# Altium project LVM PLC.PrjPcb
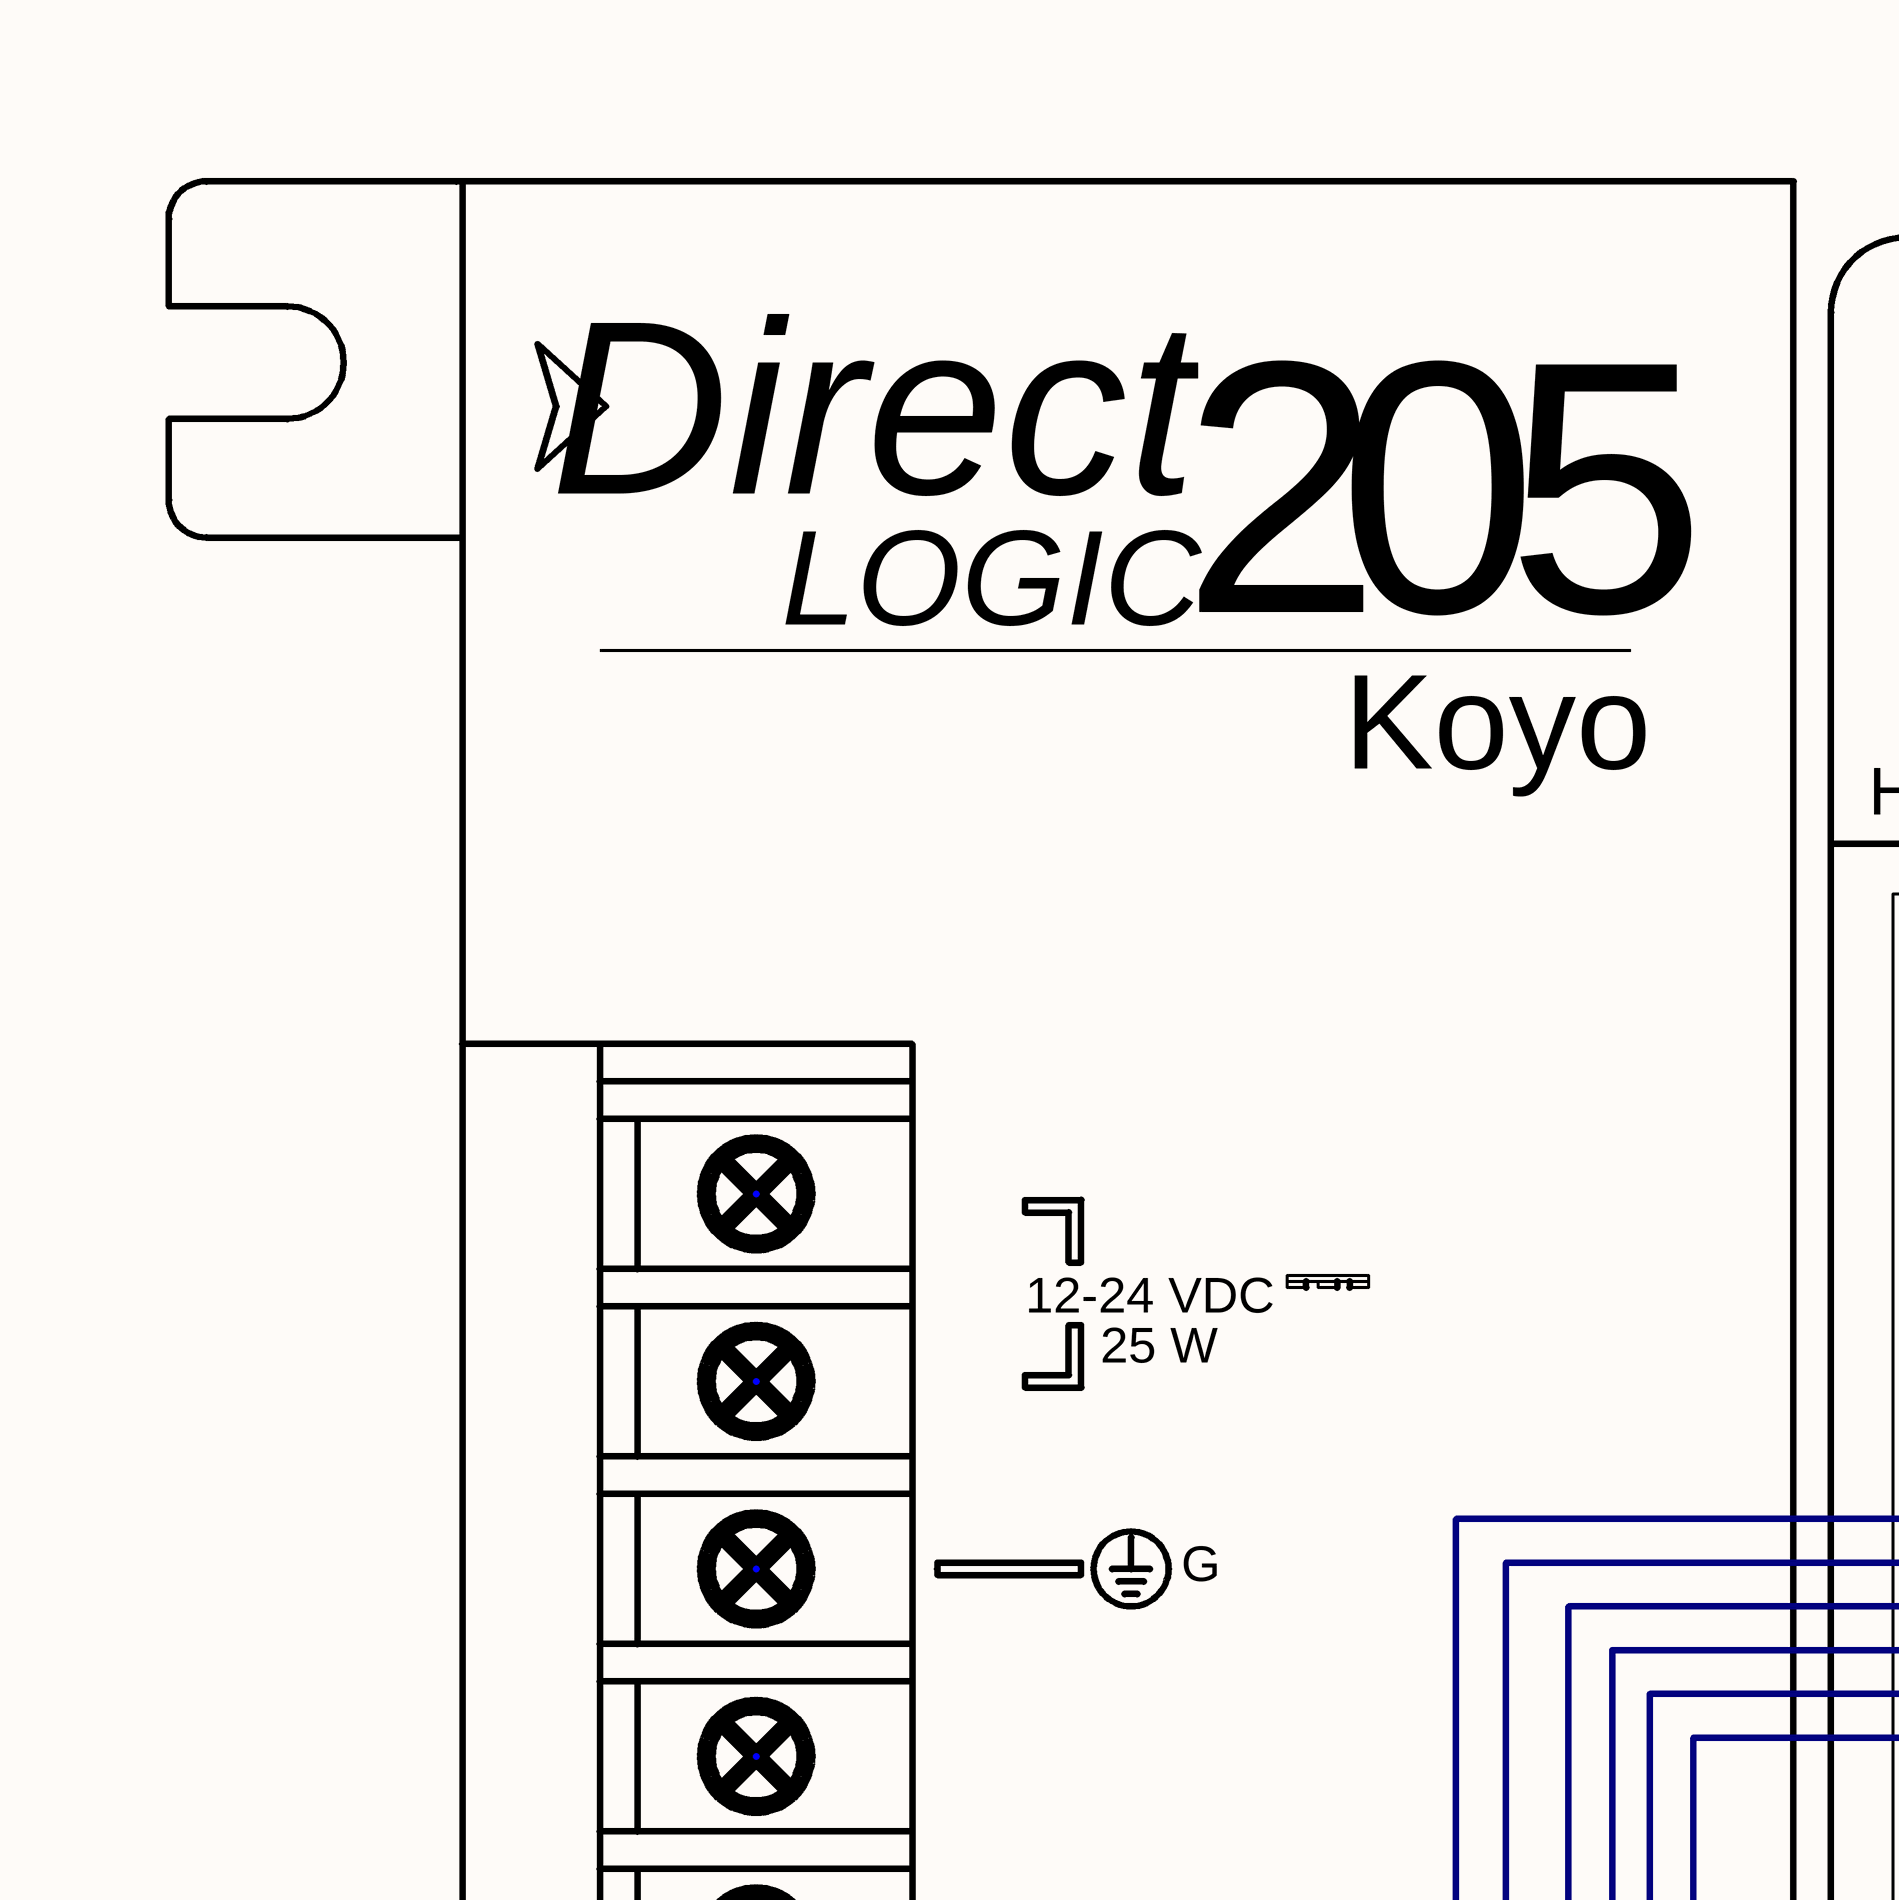
[diagram p0: LVM main.SchDoc, top column 1 of 4]
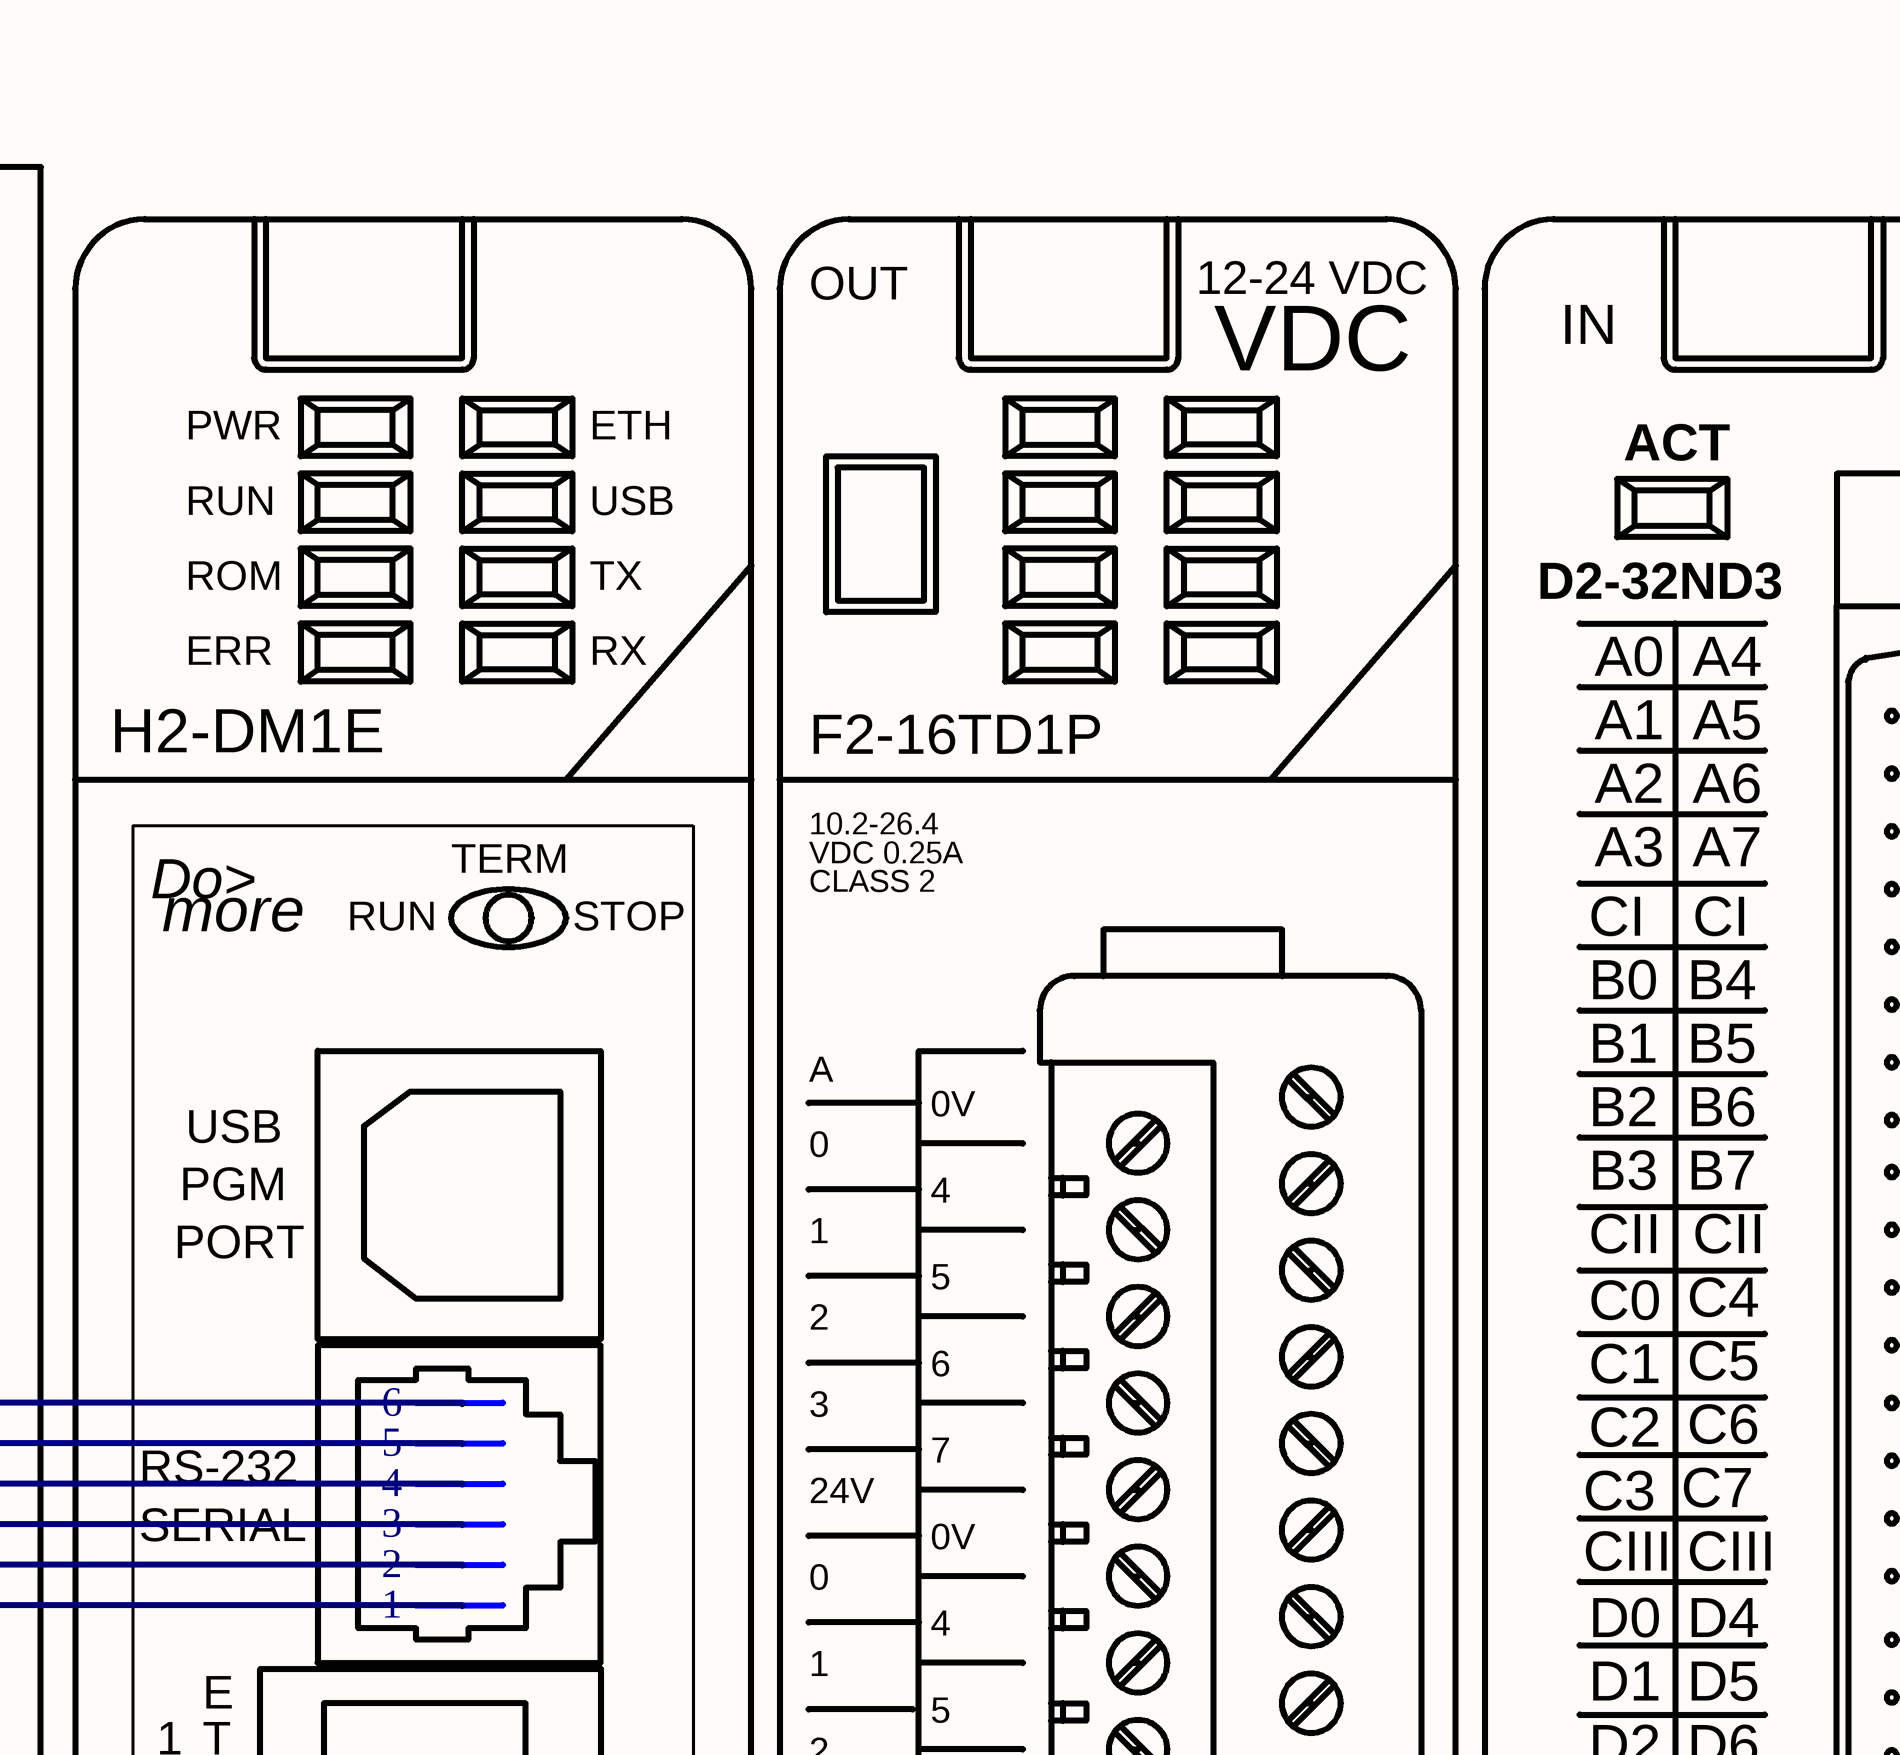
[diagram p1: LVM main.SchDoc, top column 2 of 4]
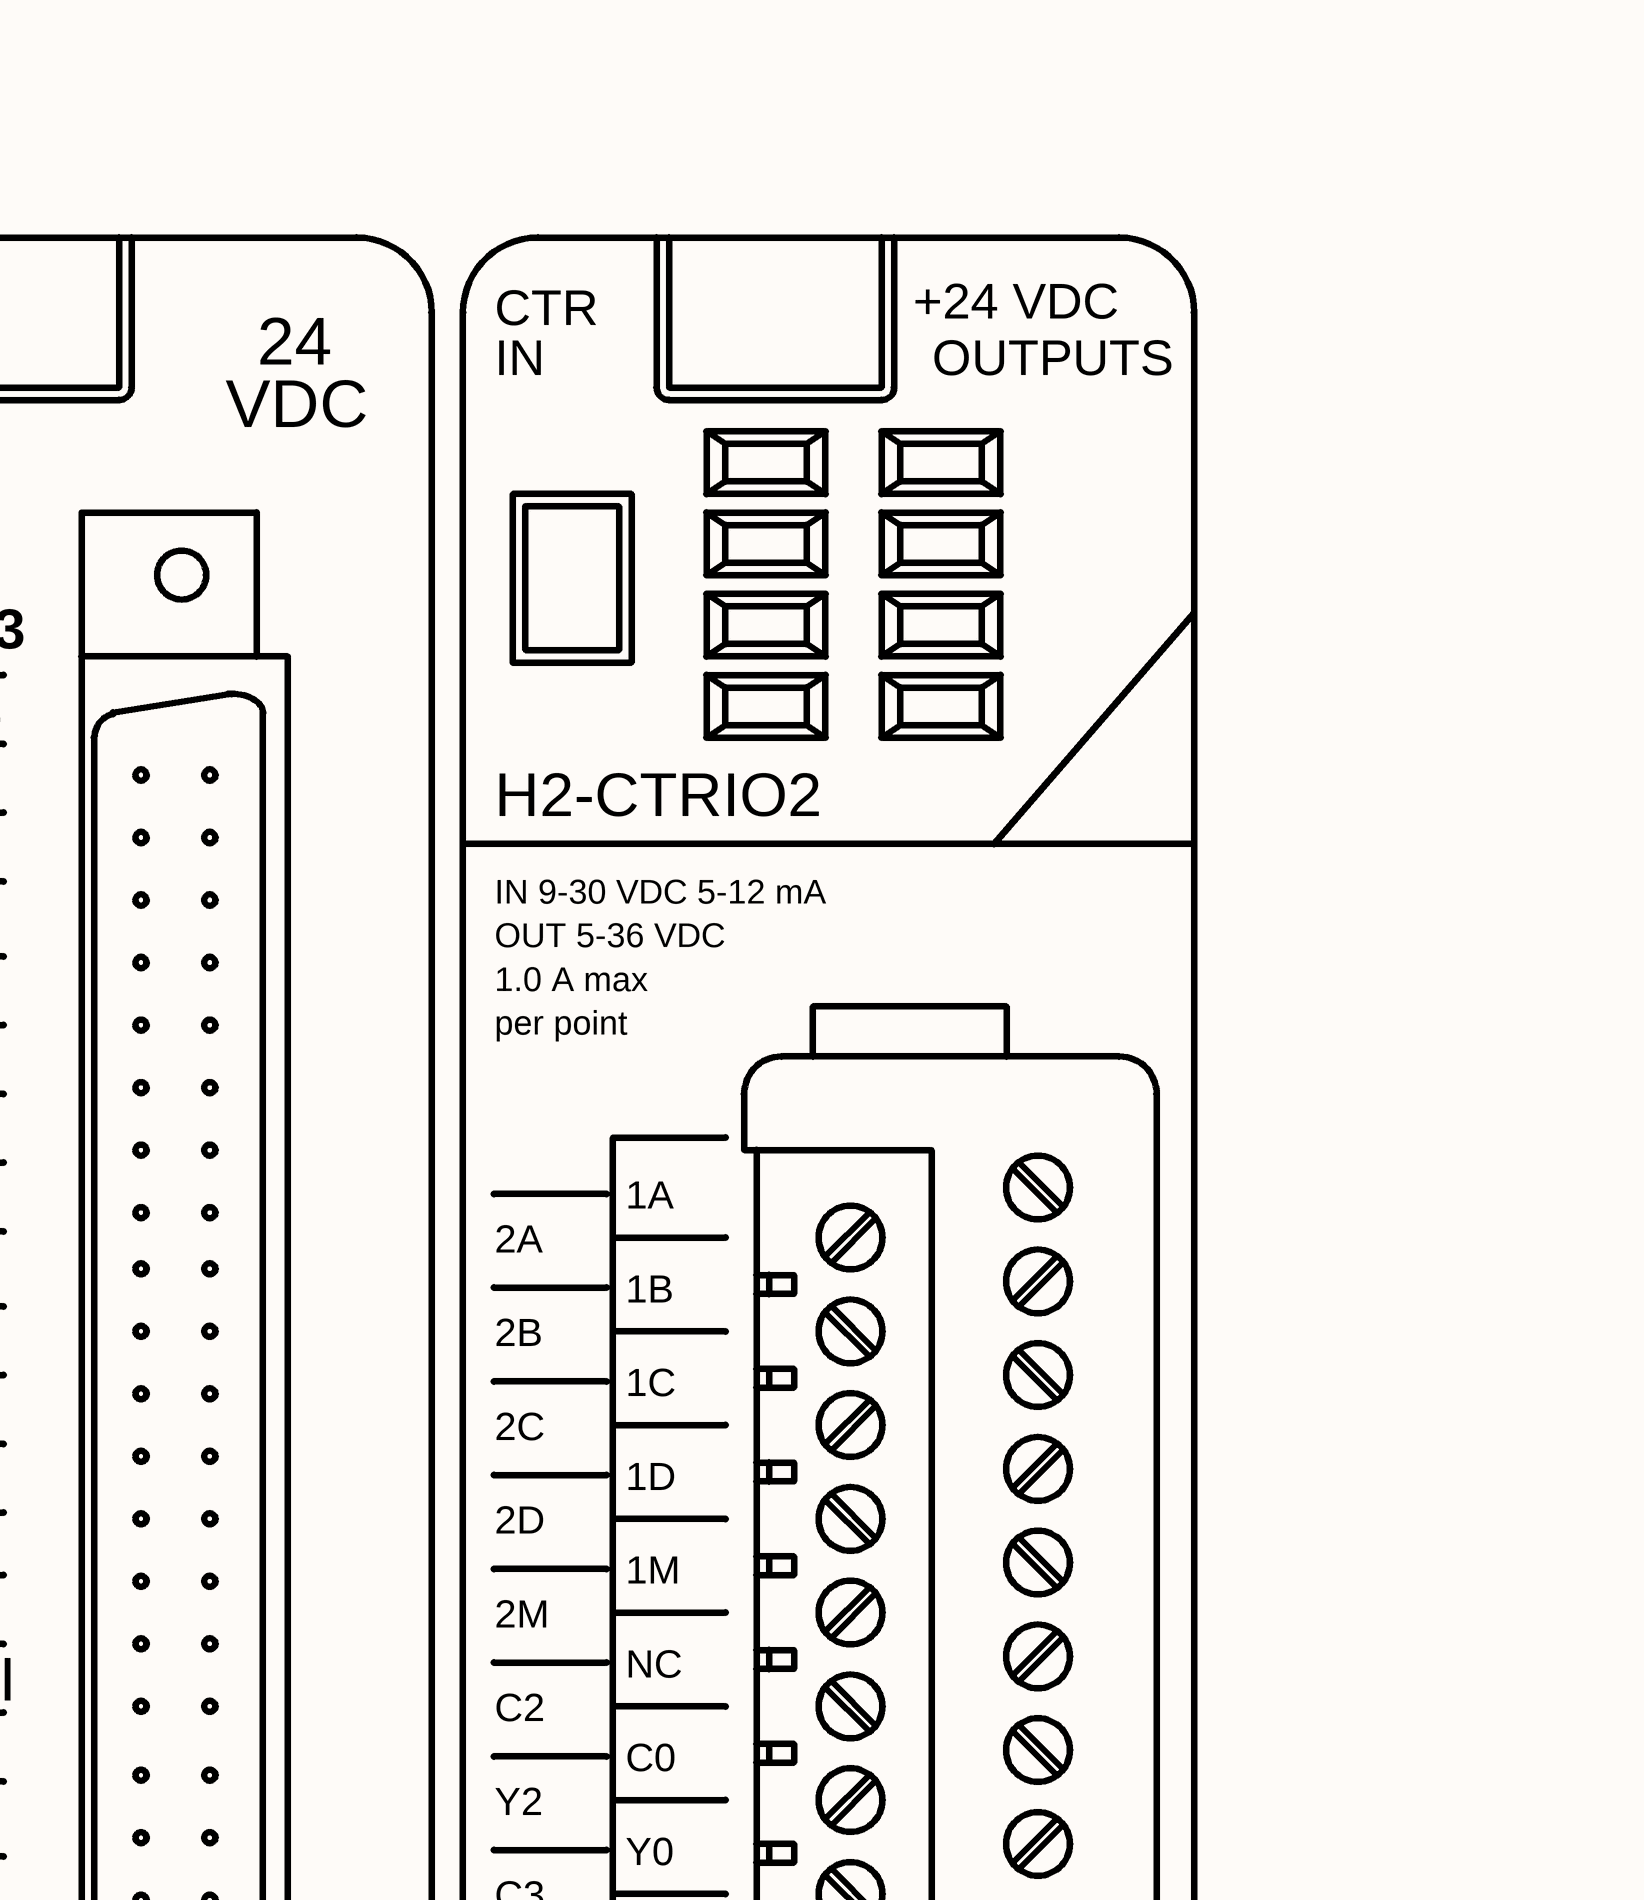
[diagram p2: LVM main.SchDoc, top column 3 of 4]
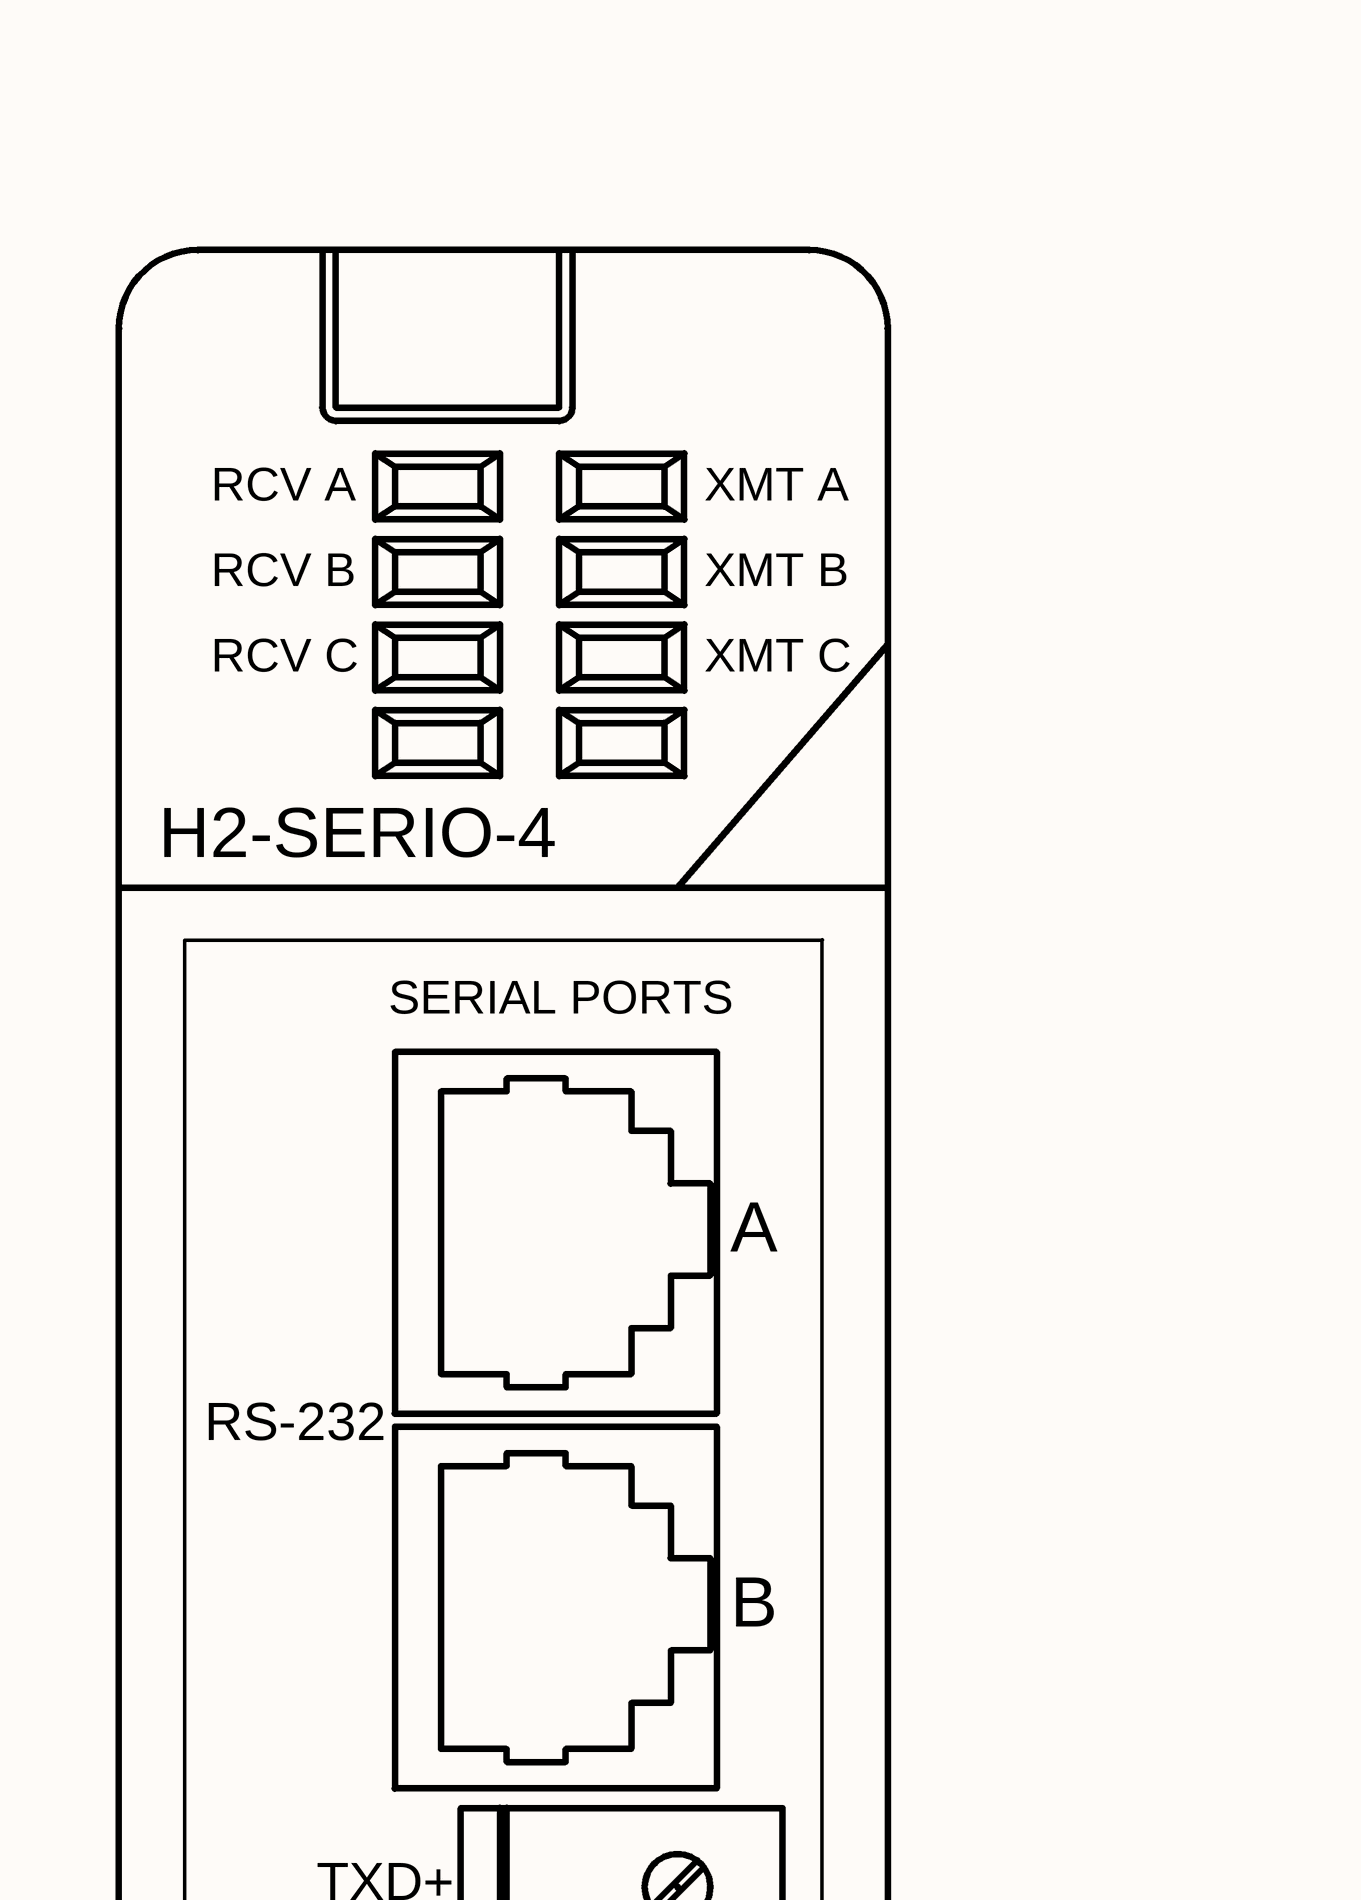
[diagram p3: LVM main.SchDoc, top column 4 of 4]
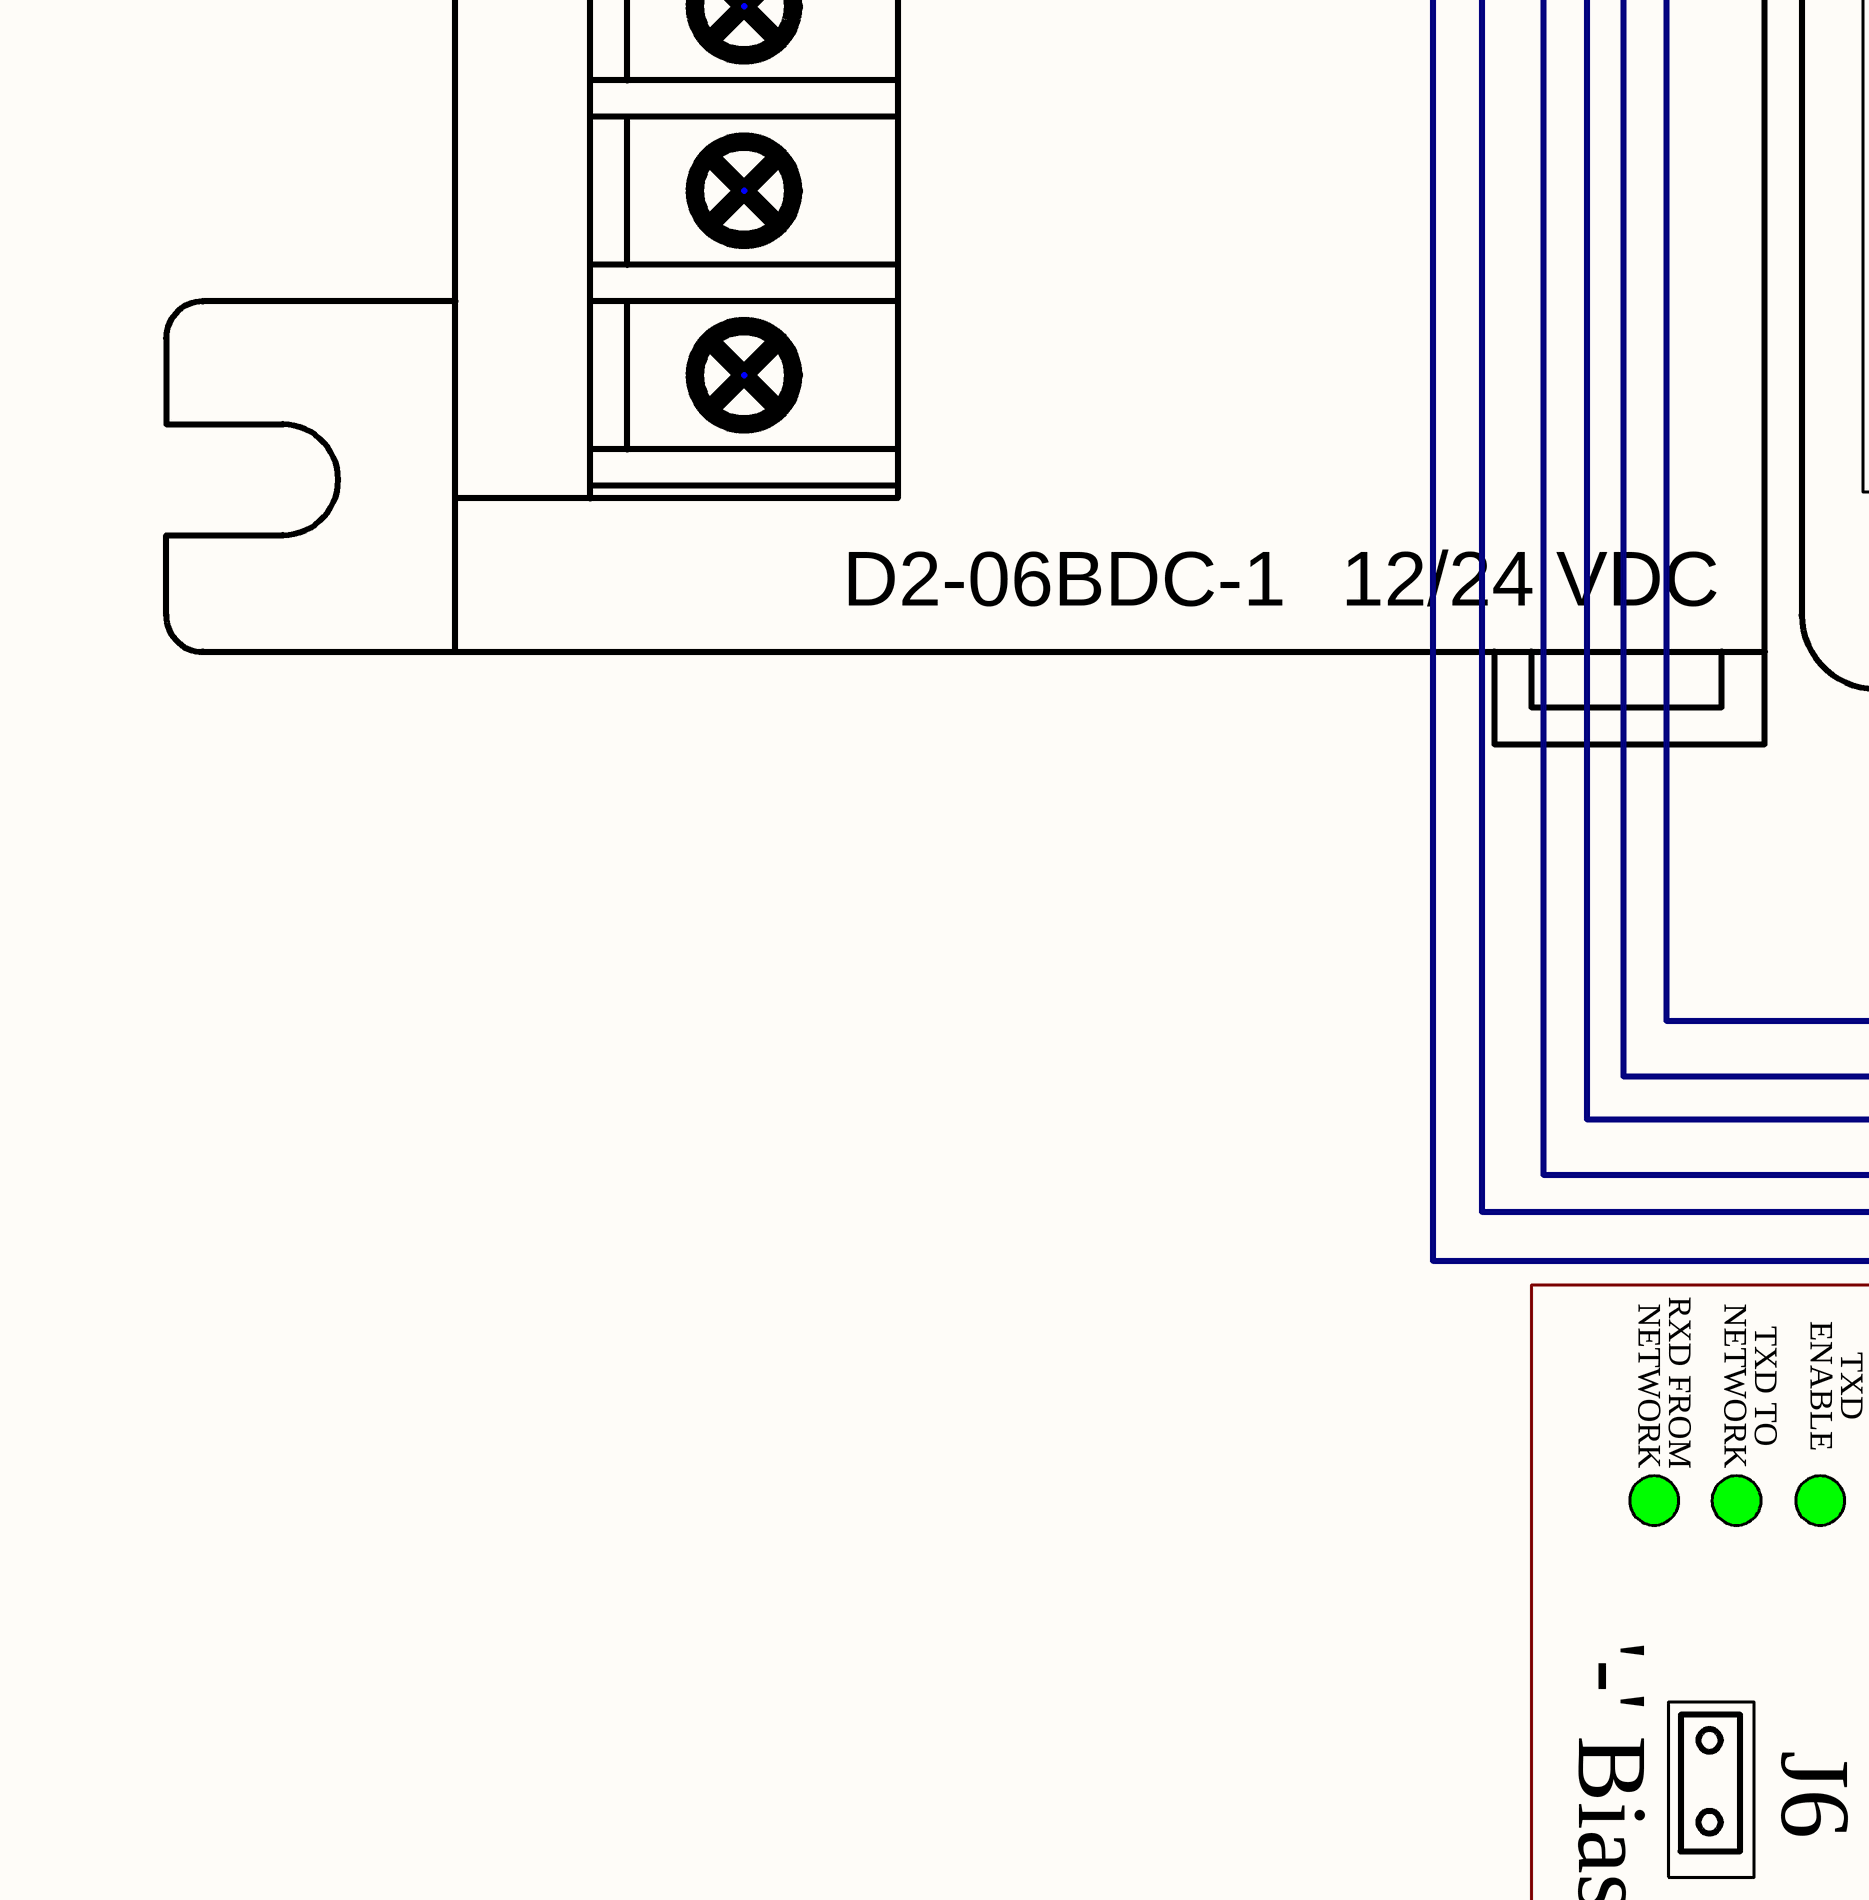
[diagram p4: LVM main.SchDoc, centre column 1 of 4]
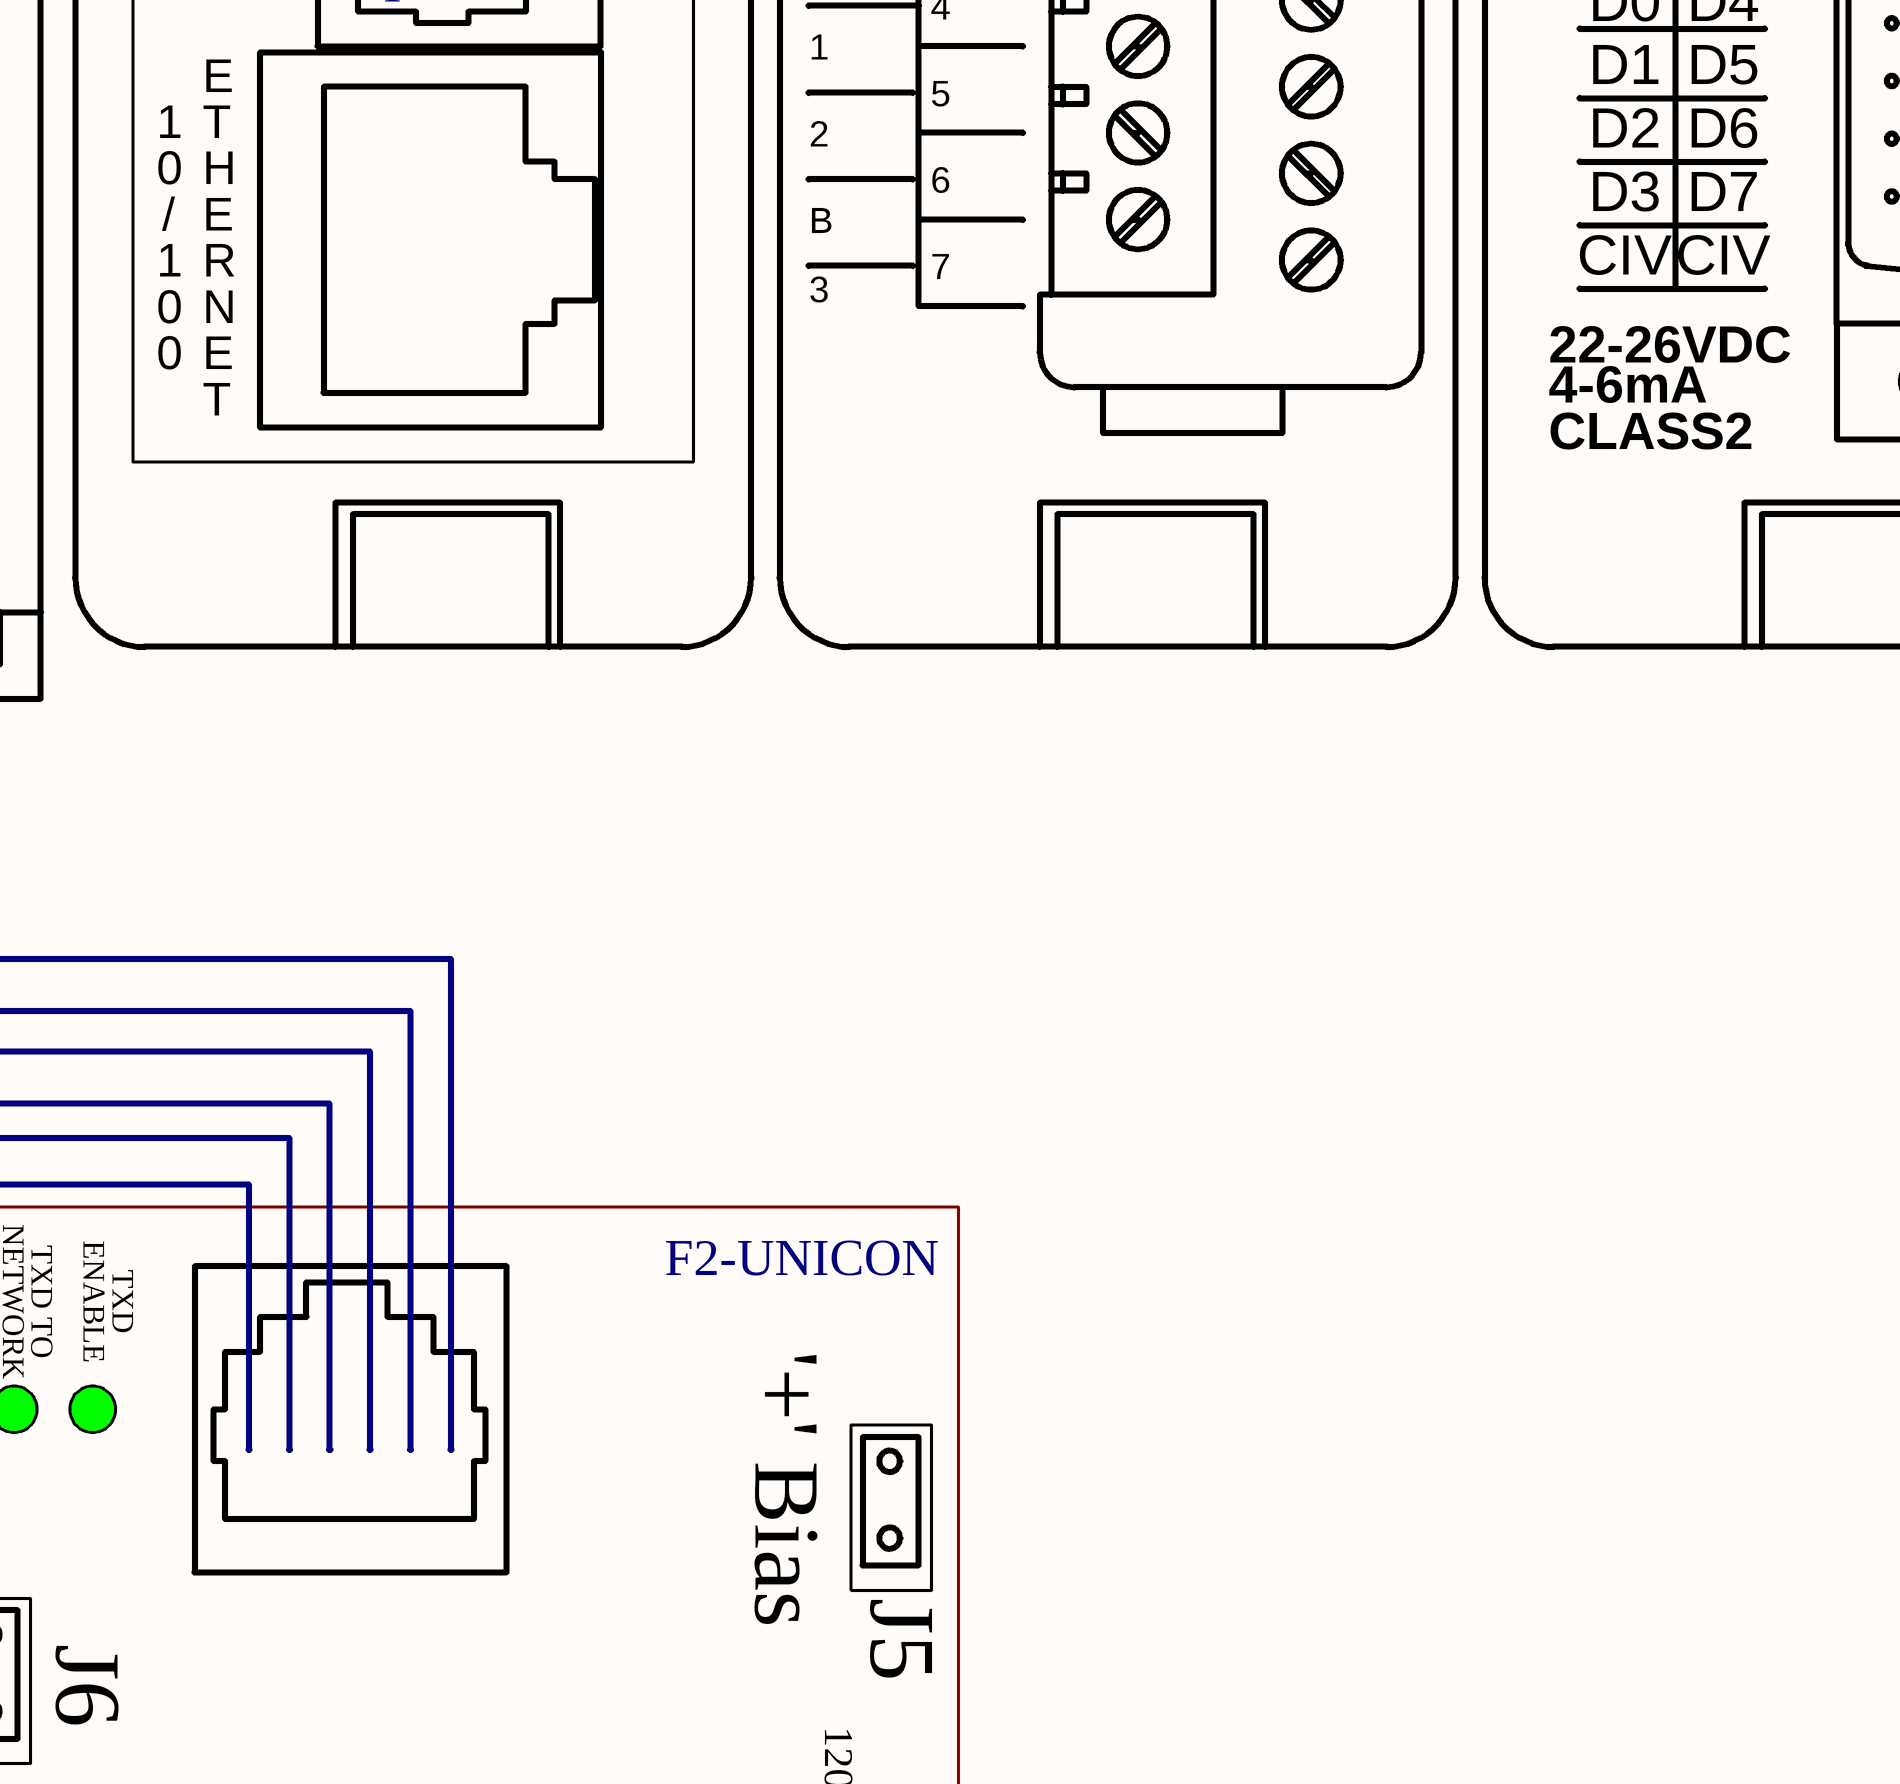
[diagram p5: LVM main.SchDoc, centre column 2 of 4]
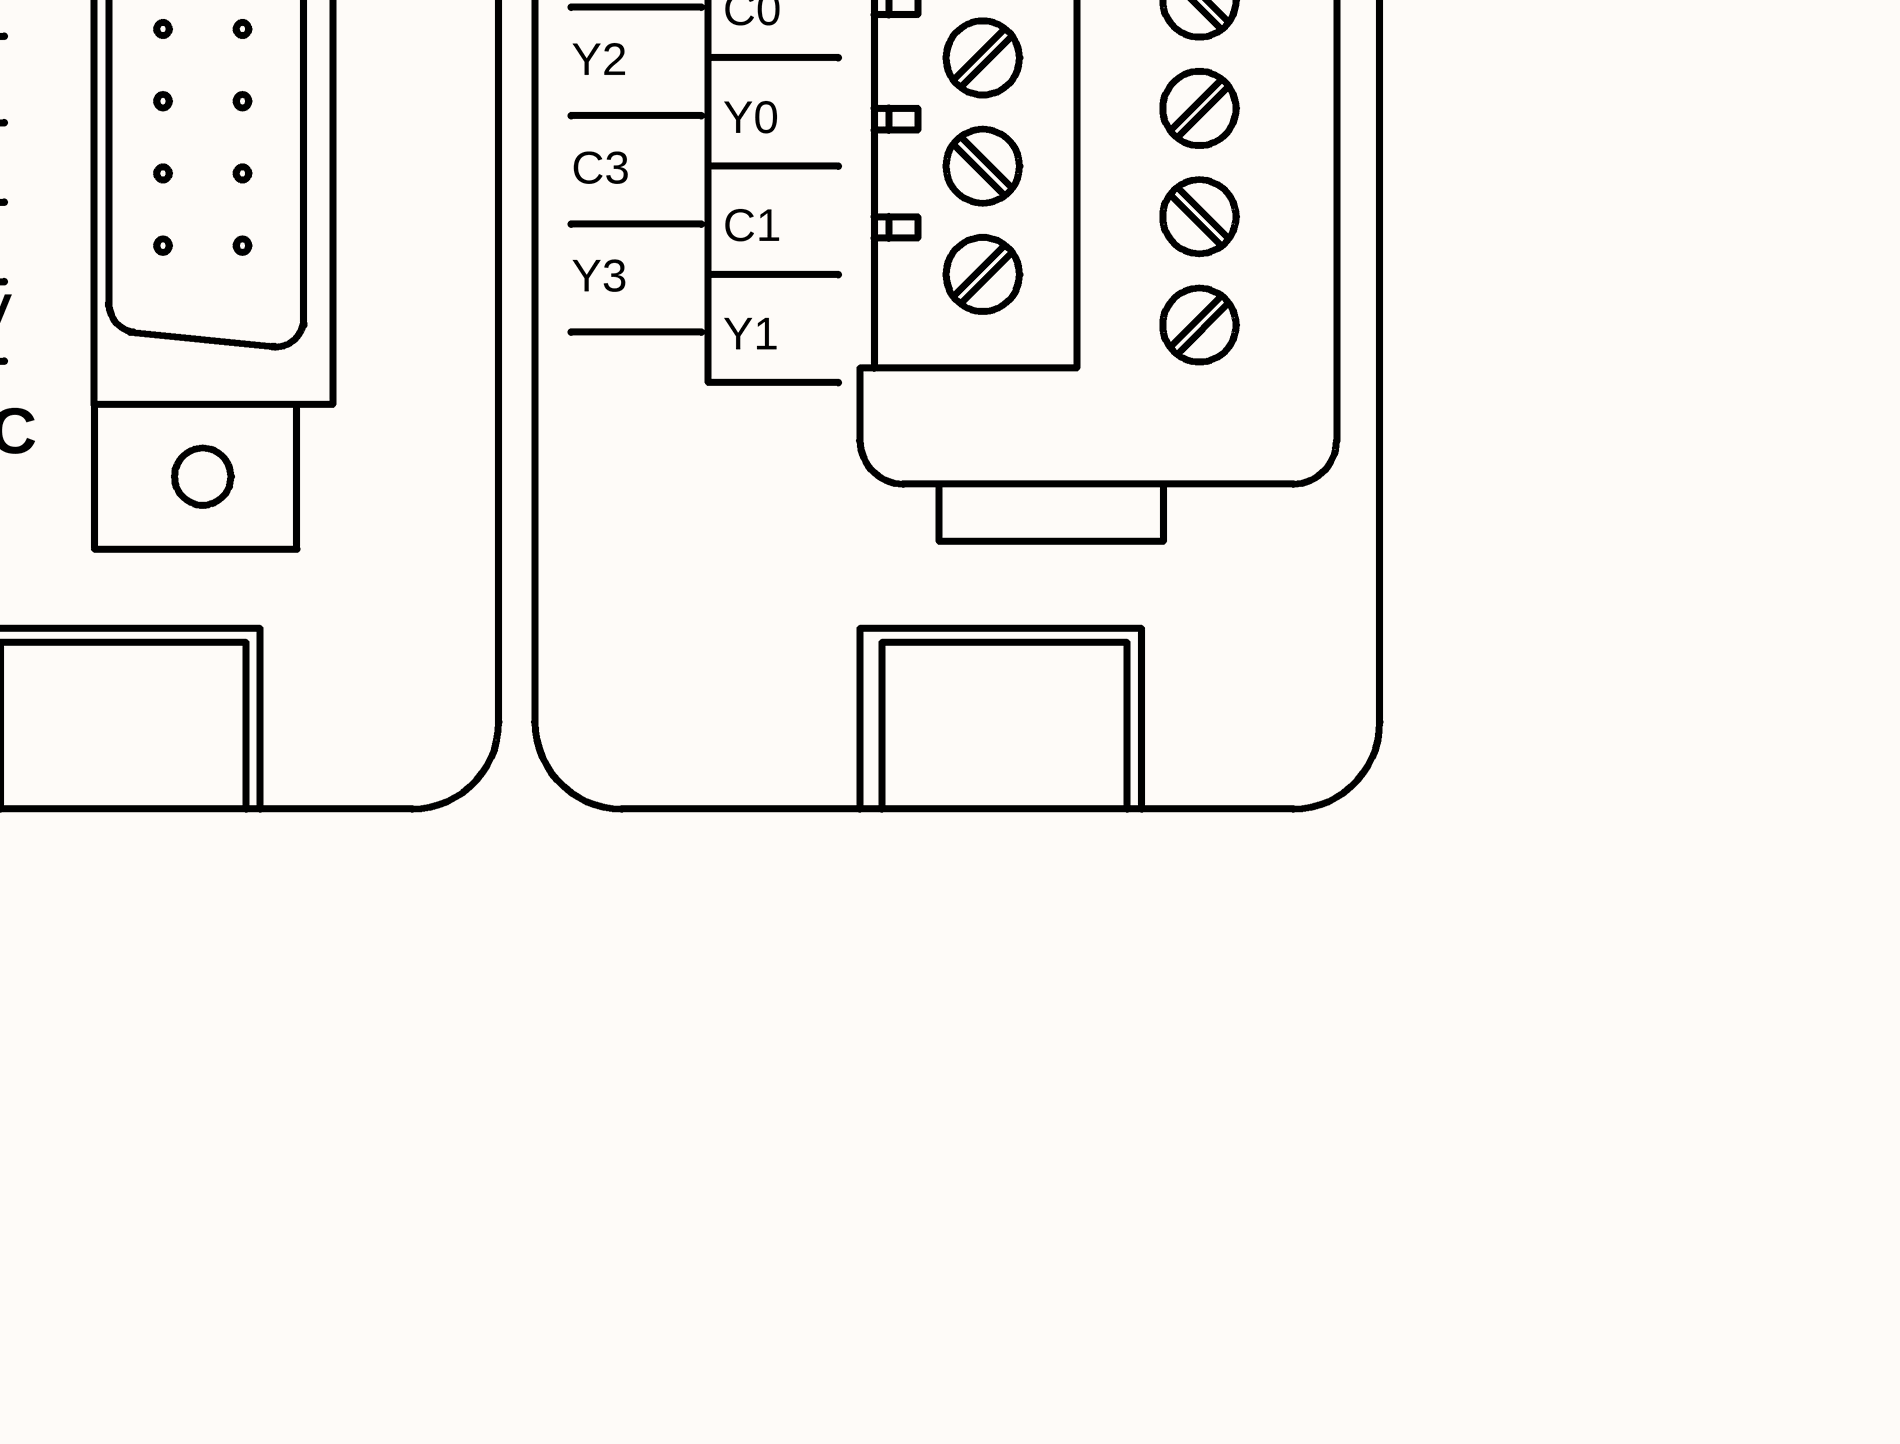
[diagram p6: LVM main.SchDoc, centre column 3 of 4]
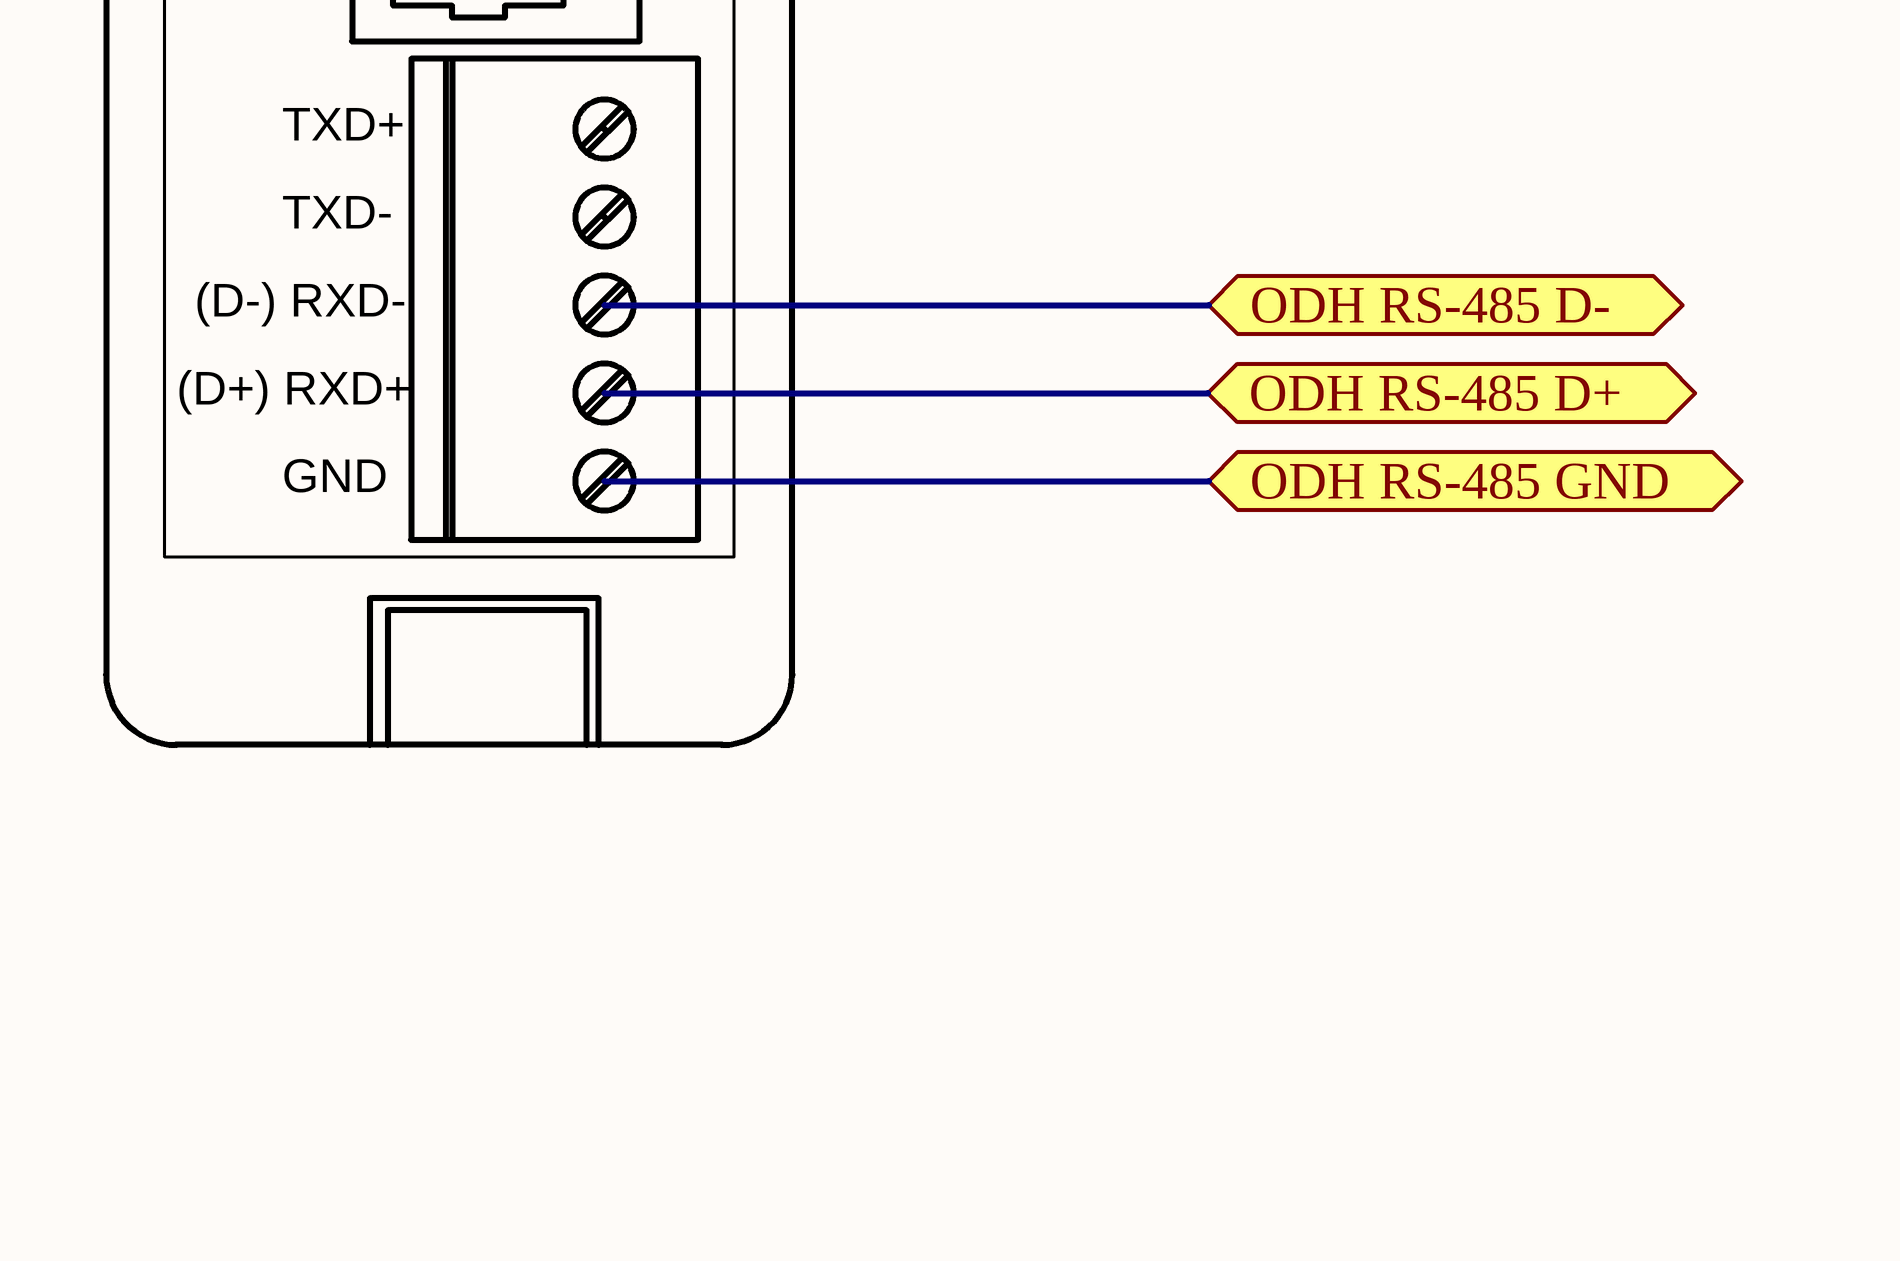
[diagram p7: LVM main.SchDoc, centre column 4 of 4]
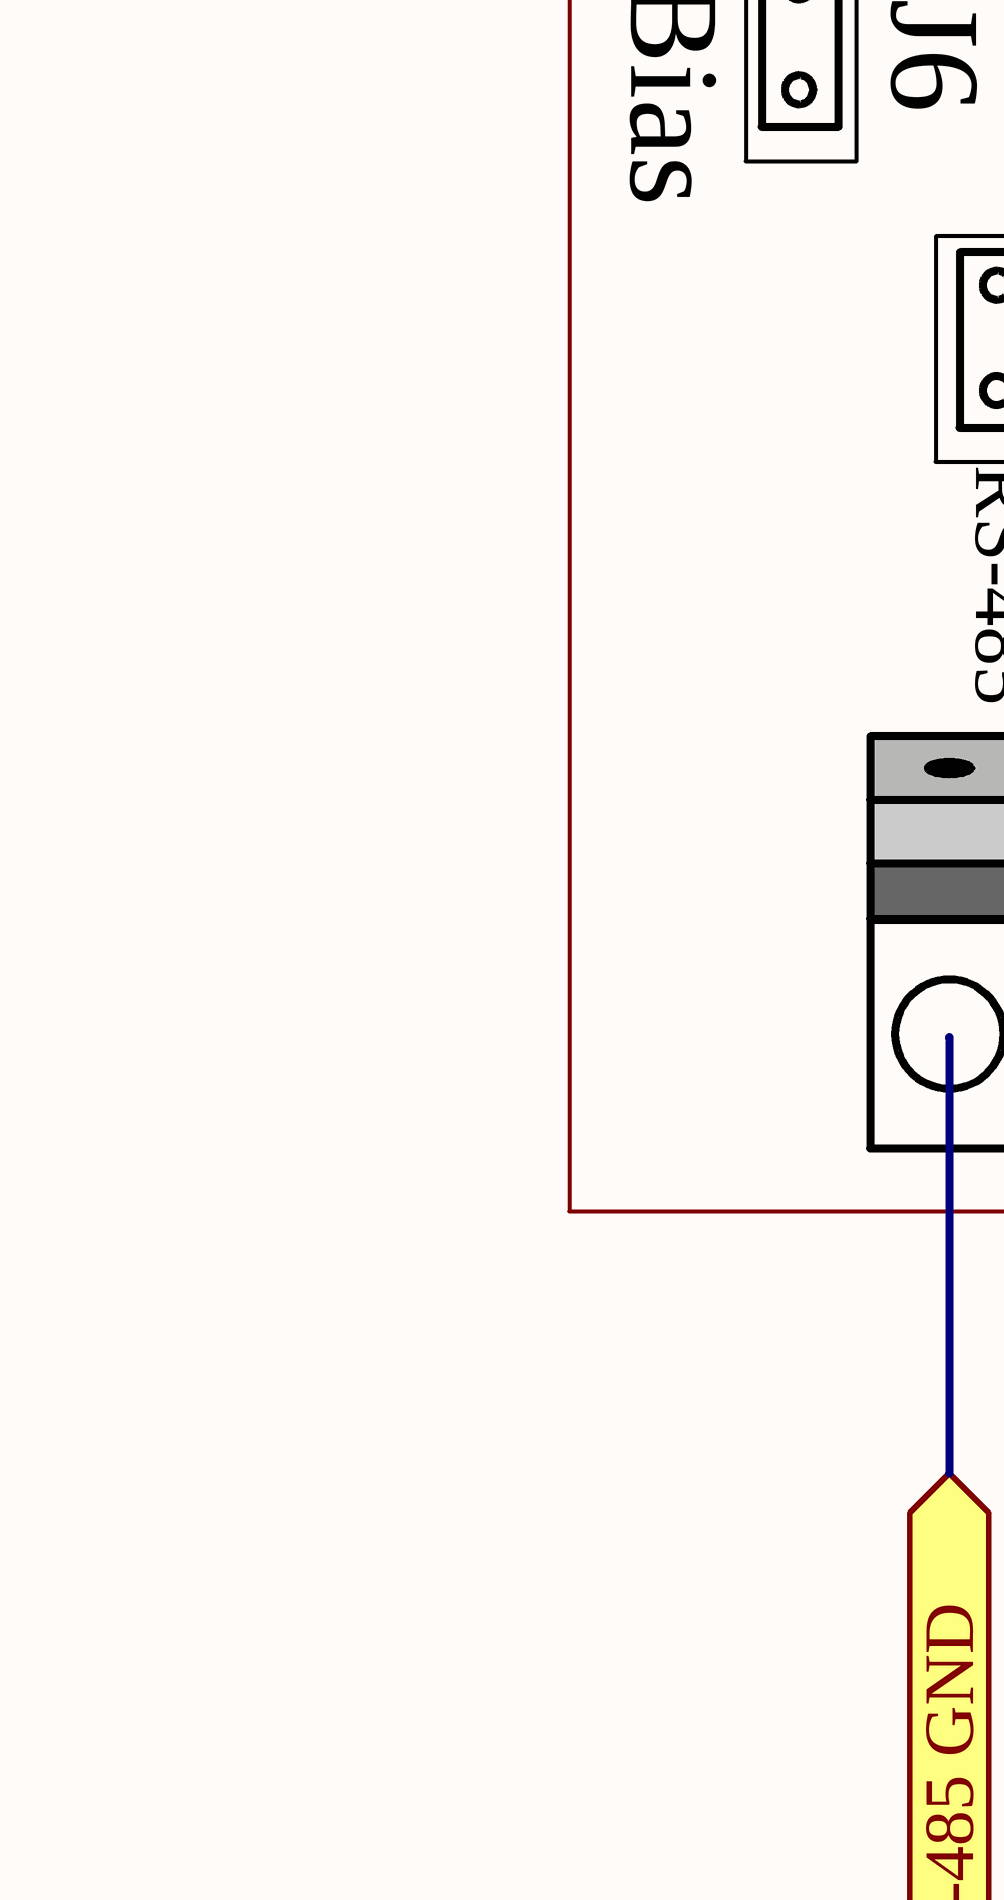
[diagram p8: LVM main.SchDoc, bottom column 1 of 4]
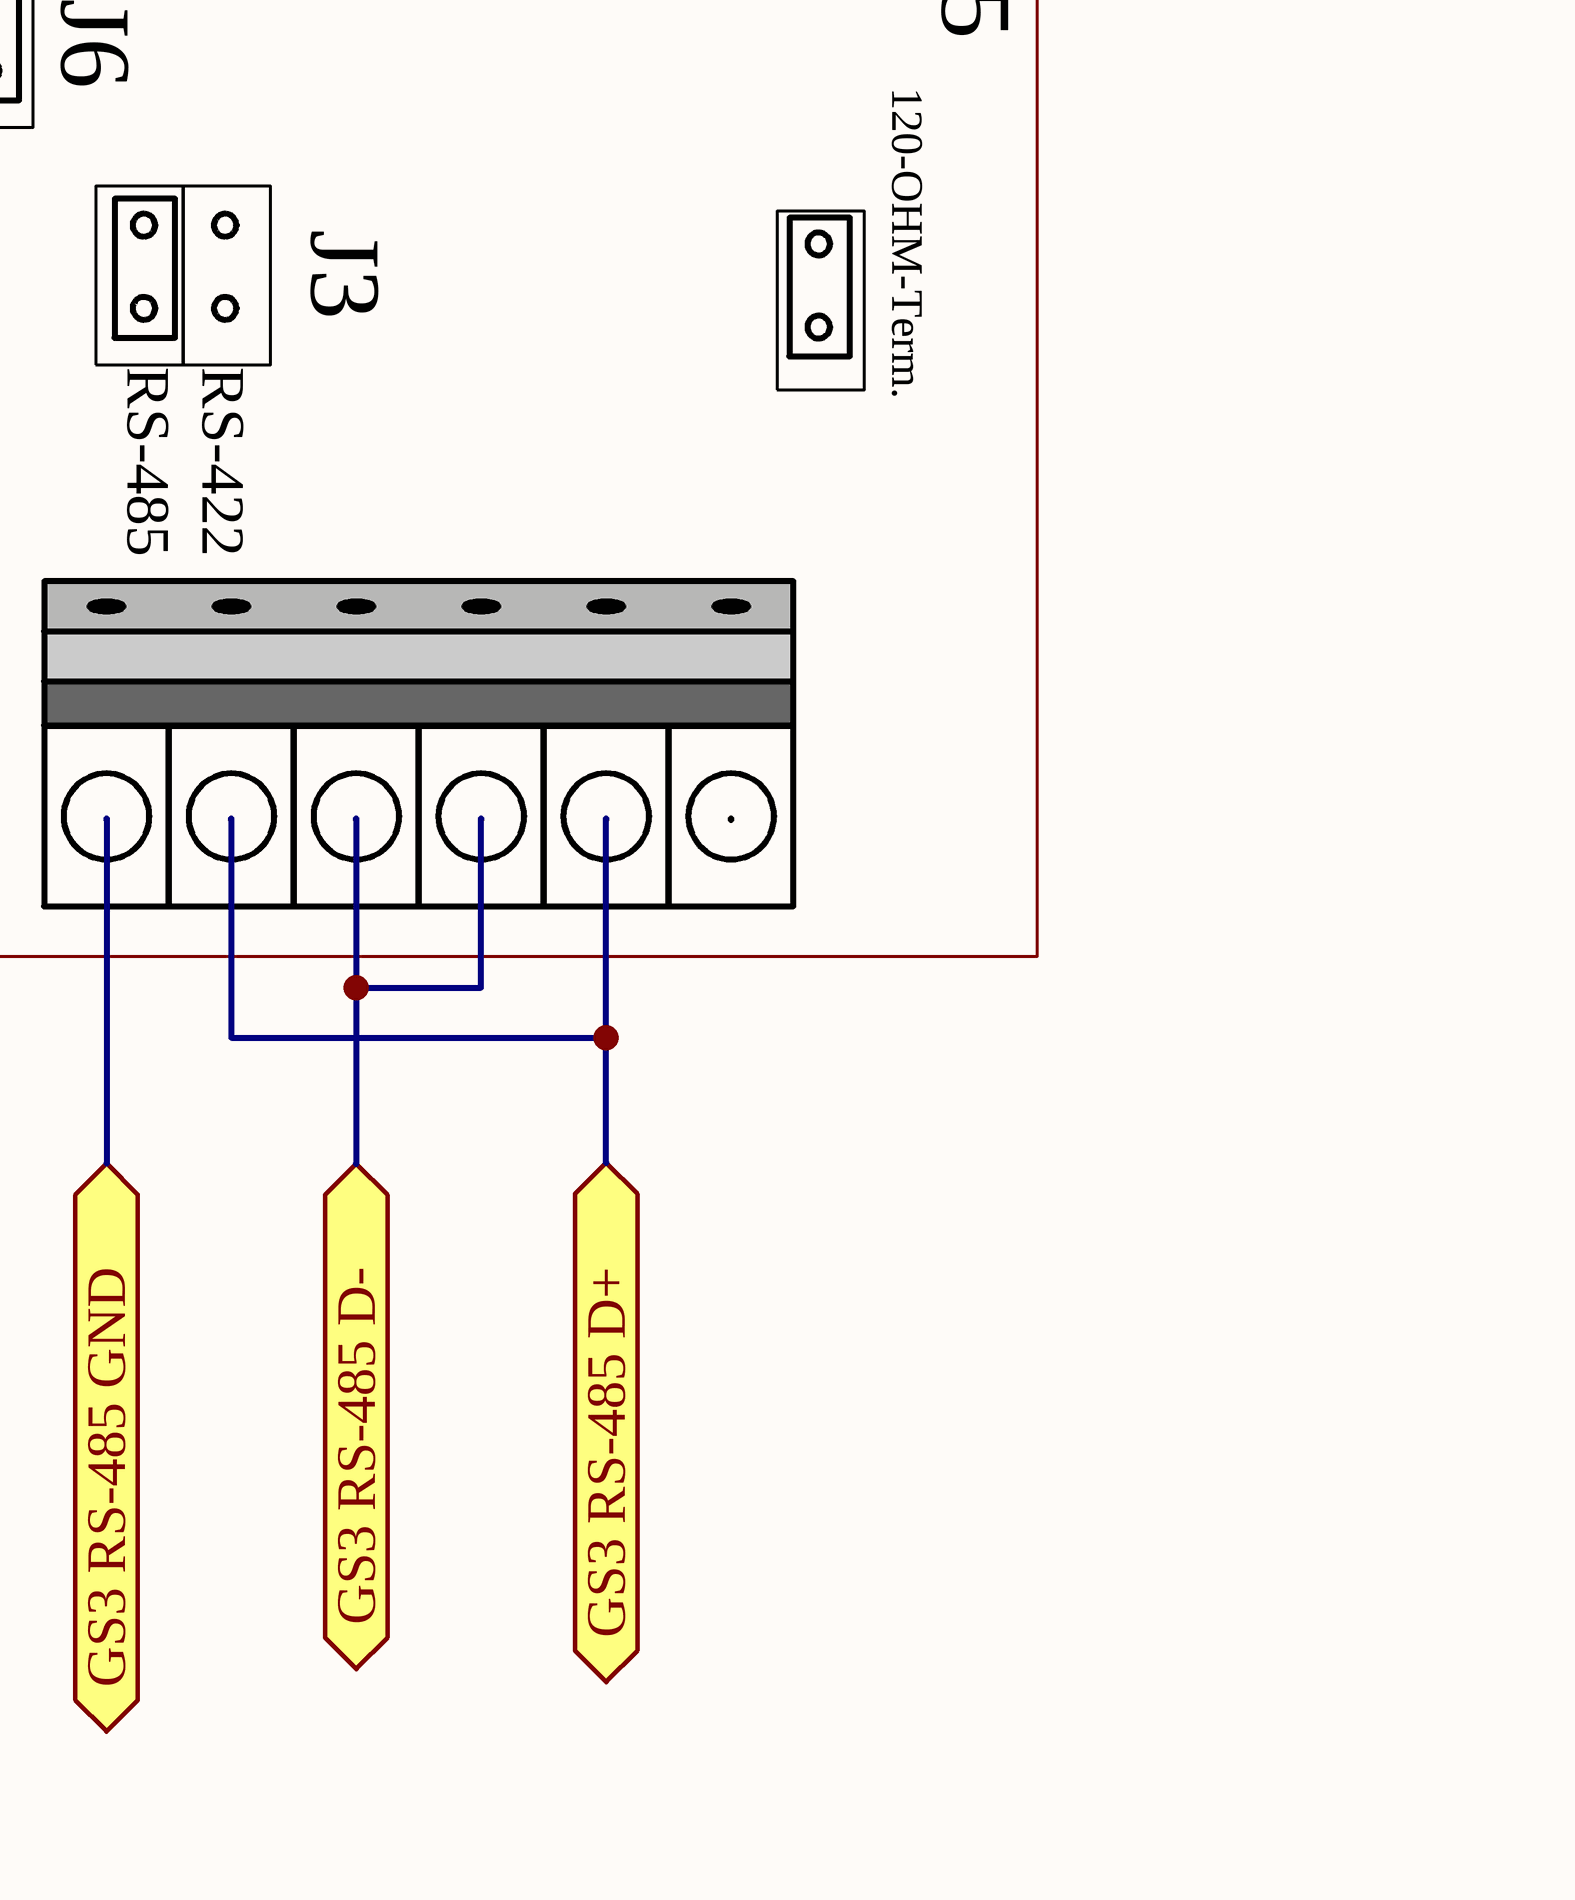
[diagram p9: LVM main.SchDoc, bottom column 2 of 4]
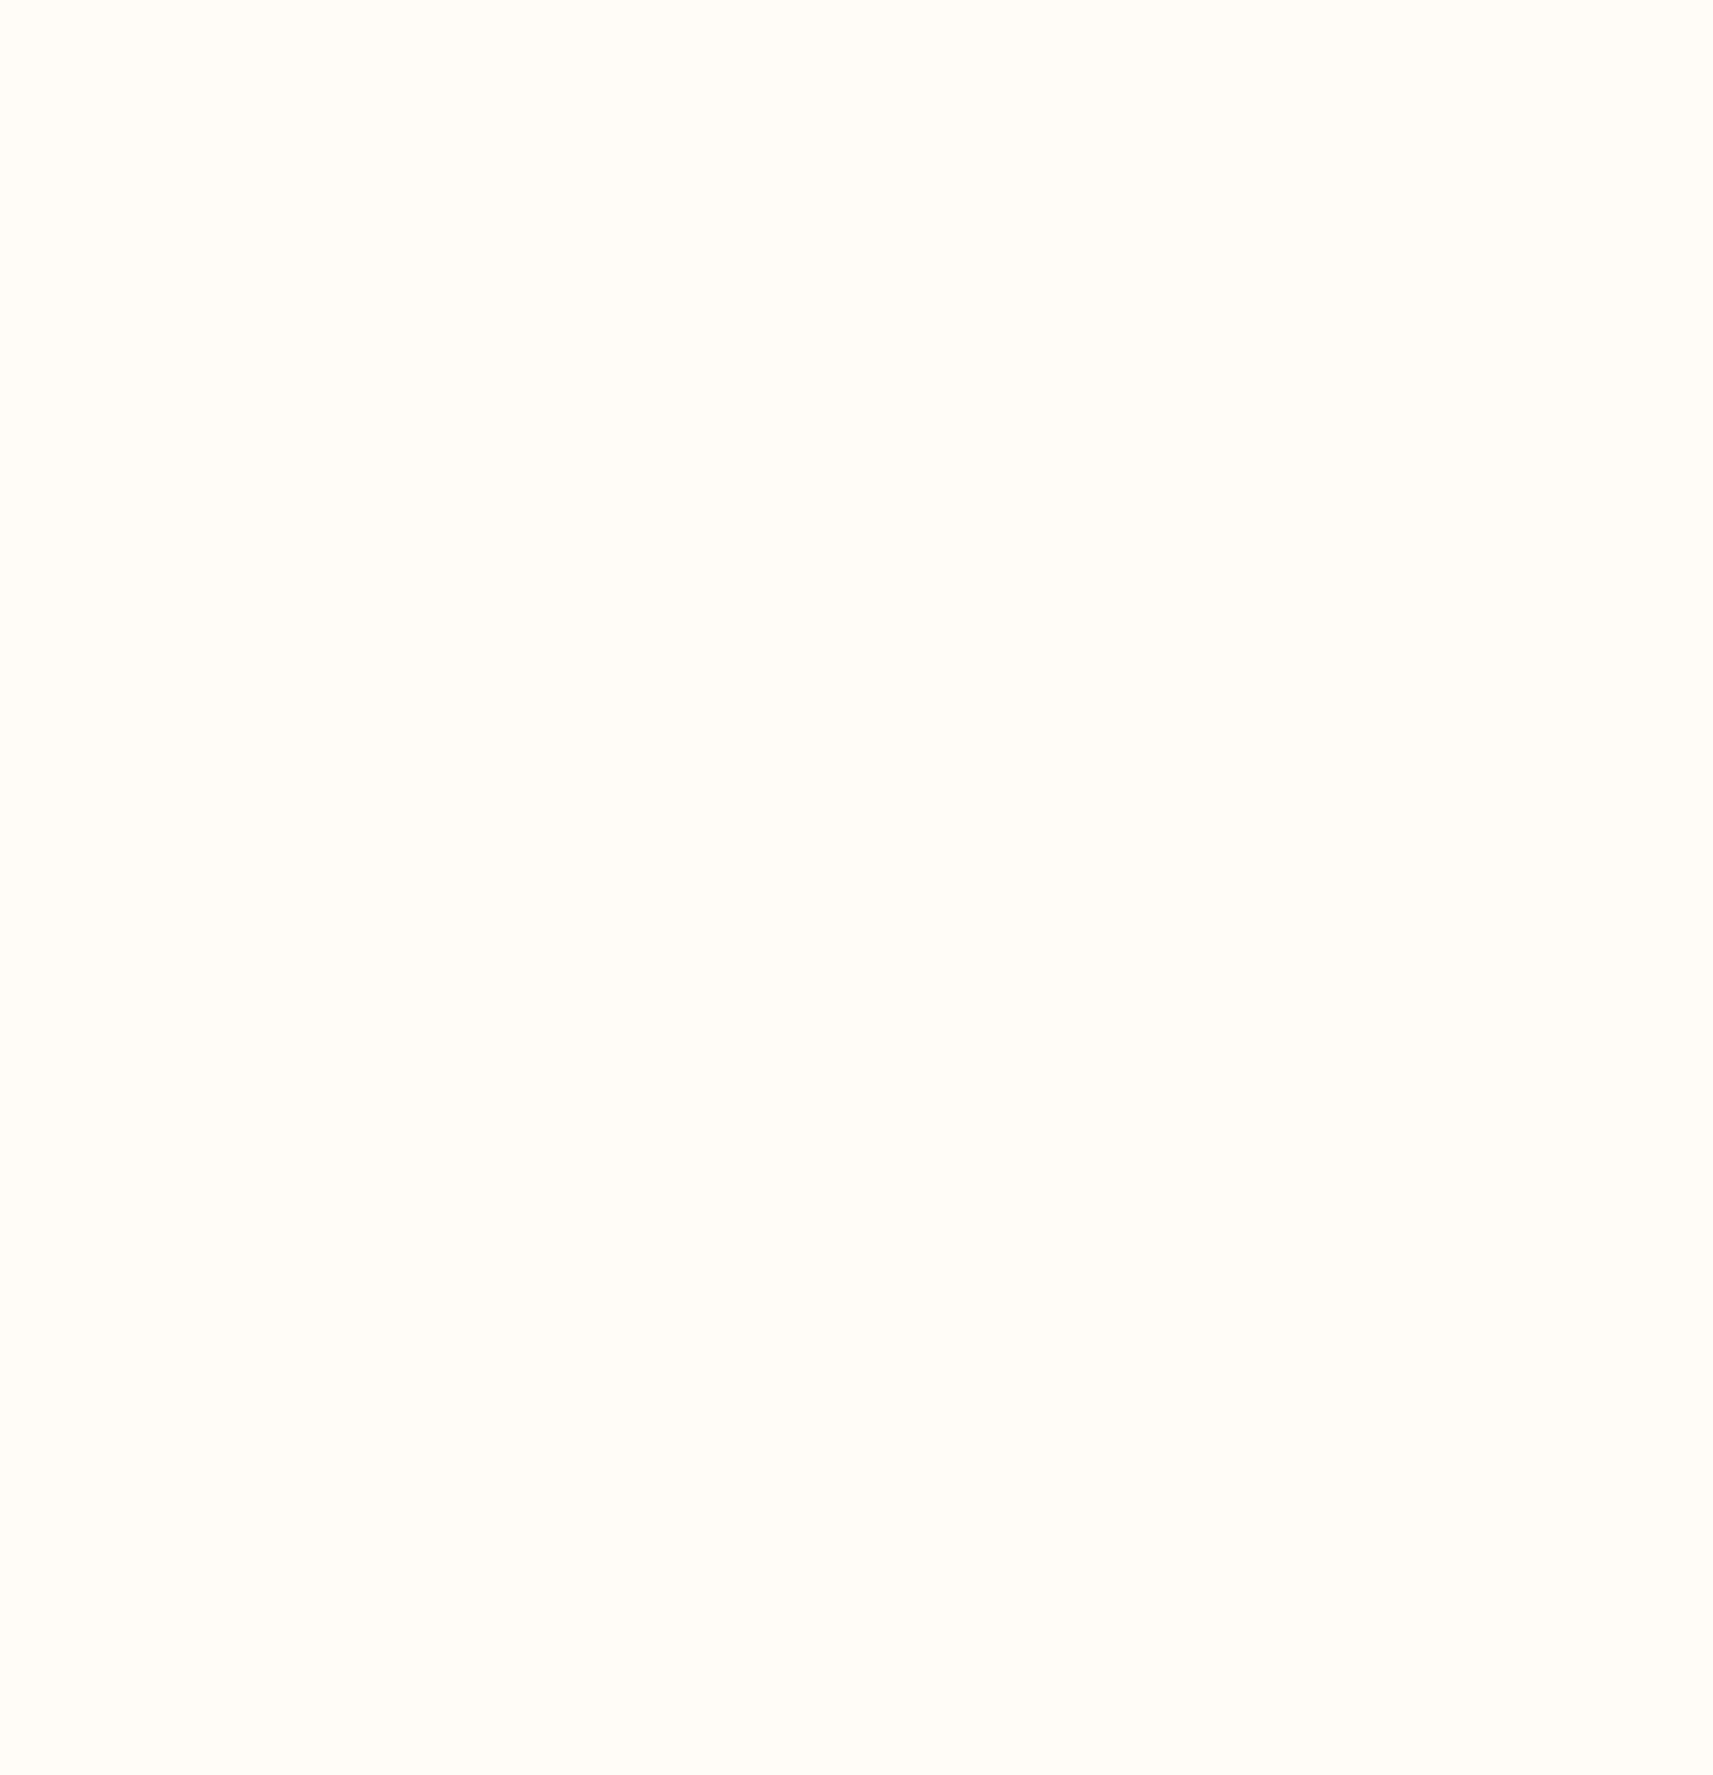
[diagram p10: LVM main.SchDoc, bottom column 4 of 4]
3 sheets, 10 parts. Net scope: flat (ports and power ports of the same name join across sheets).
Sheets:
  LVM main.SchDoc
  PLC out.SchDoc
  PLC in.SchDoc

## Sheet LVM main.SchDoc: LVM PLC setup
size A3; Author: Felipe Besser P.; CompanyName: Observatorio Las Campanas; DocumentNumber: 1; Revision: 1; SheetNumber: 1; SheetTotal: 3

### Parts
(Parts that share a designator on the sheet are numbered #1, #2 ... from top to bottom, then left to right.)
1  H2-DM1E  (value not drawn)
*2  F2-16TD1P  (value not drawn)
*3  H2-CTRIO2  (value not drawn)
*4  H2-SERIO-4  (value not drawn)
*5  Parameter 1: D2-06BDC-1  (hidden comment: D2-0xBDC-1 DL205 PLC Base)
?#1  (no value)
?#2  F2-UNICON

### Ports
GS3 RS-485 D+ (bidir), GS3 RS-485 D- (bidir), GS3 RS-485 GND (bidir), ODH RS-485 D+ (bidir), ODH RS-485 D- (bidir), ODH RS-485 GND (bidir)

### Nets
Net1_?1: 1.?1(CTS) ?#2.?7(CTS)
Net1_?2: 1.?2(RTS) ?#2.?8(RTS)
Net1_?3: 1.?3(TXD) ?#2.?9(TXD)
Net1_?4: 1.?4(RXD) ?#2.?10(RXD)
Net1_?5: 1.?5(+5V) ?#2.?11(+5V)
Net1_?6: 1.?6(GND) ?#2.?12(GND)
Net*4_?3: *4.?3(RXD-_(D-)) ; port ODH RS-485 D-
Net*4_?4: *4.?4(RXD+_(D+)) ; port ODH RS-485 D+
Net*4_?5: *4.?5(GND) ; port ODH RS-485 GND
Net?#2_?1: ?#2.?1(RS-4xx_GND) ; port GS3 RS-485 GND
Net?#2_?2: ?#2.?2(RS-4xx_TX+) ?#2.?5(RS-4xx_RX+) ; port GS3 RS-485 D+
Net?#2_?3: ?#2.?3(RS-4xx_TXD-) ?#2.?4(RS-4xx_RXD-) ; port GS3 RS-485 D-

Not connected (* = marked no-connect by the designer): *2 ?1(A0) ?2(A1) ?3(A4) ?4(A5) ?5(A2) ?6(A6) ?7(A3) ?8(A7) ?9(24V) ?10(0V) ?11(B0) ?12(B1) ?13(B4) ?14(B2) ?15(B5) ?16(B3) ?17(B6) ?18(B7) ?19(0V); *4 ?1(TXD+) ?2(TXD-); *5 0(6) 1(6) 2(6) 3(6) 4(6) 5(6); ?#2 ?6(5V)

### Notes on the sheet
- (in symbol D2-0xBDC-1 DL205 PLC Base) Direct; LOGIC; Koyo; 12-24 VDC; 25 W; G; 12/24 VDC
- (in symbol D2-32ND) IN; 24; VDC; ACT; D2-32ND3; A0; A4; A1; A5; A2; A6; A3; A7; CI; B0; B4; B1; B5; B2; B6; B3; B7; CII; C0; C4; C1; C5; C2; C6; C7; C3; CIII; D0; D4; D1; D5; D2; D6; D3; D7; CIV; 22-26VDC; 4-6mA; CLASS2
- (in symbol F2-16TD1P) 12-24 VDC; OUT; VDC; 10.2-26.4; VDC 0.25A; CLASS 2; A; 0; 4; 1; 5; 2; 6; 3; 7; B
- (in symbol F2-UNICON) NETWORK; RXD FROM; TXD TO; ENABLE; '+' Bias; J5; '-' Bias; J6; 120-OHM-Term.; J3; RS-485; RS-422
- (in symbol H2-CTRIO2) +24 VDC; CTR; IN; OUTPUTS; IN 9-30 VDC 5-12 mA; OUT 5-36 VDC; 1.0 A max; per point; 1A; 2A; 1B; 2B; 1C; 2C; 1D; 2D; 1M; 2M; NC; C2; C0; Y2; Y0; C3; C1; Y3; Y1
- (in symbol H2-DM1E) PWR; ETH; RUN; USB; ROM; TX; ERR; RX; TERM; Do>; STOP; more; PGM; PORT; 6; 5; RS-232; 4; 3; SERIAL; 2; E; T; 0; H; /; R; N
- (in symbol H2-SERIO-4) RCV A; XMT A; RCV B; XMT B; RCV C; XMT C; SERIAL PORTS; A; RS-232; B; (D-) RXD-; (D+) RXD+

### Library data of the parts
?#1 = D2-32ND

## Sheet PLC out.SchDoc: Enclosure PLC outputs
size A4; Author: Felipe Besser P.; CompanyName: Observatorio Las Campanas; DrawnBy: Felipe Besser P.; DocumentNumber: 3; Revision: 1; SheetNumber: 2; SheetTotal: 3
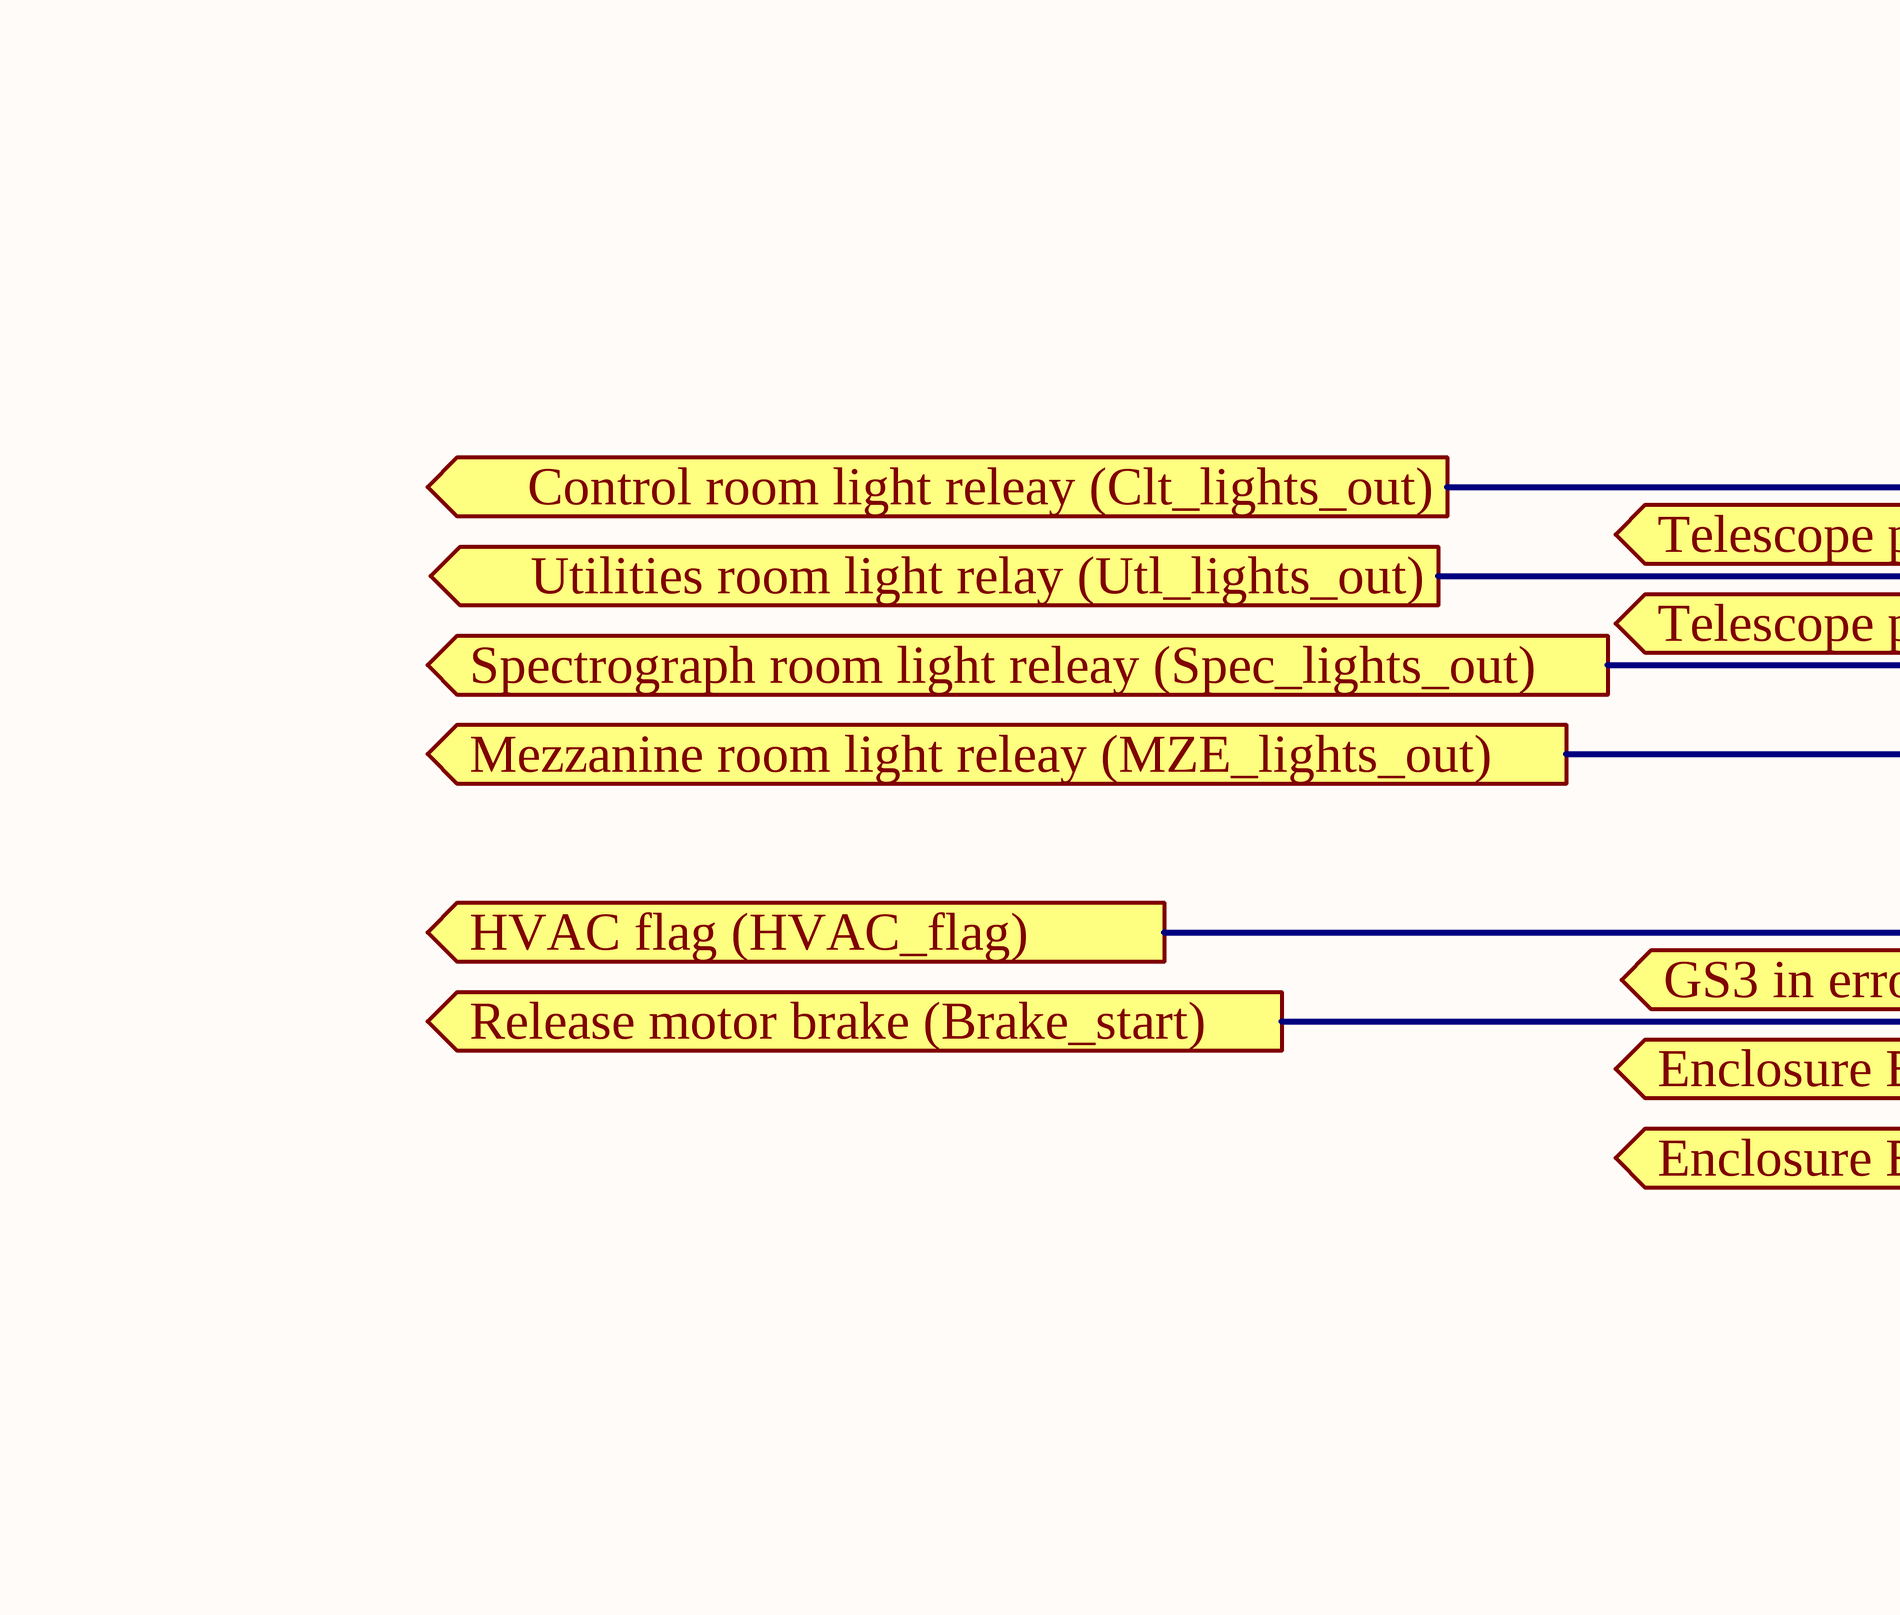
[diagram p11: PLC out.SchDoc, bottom column 3 of 4]
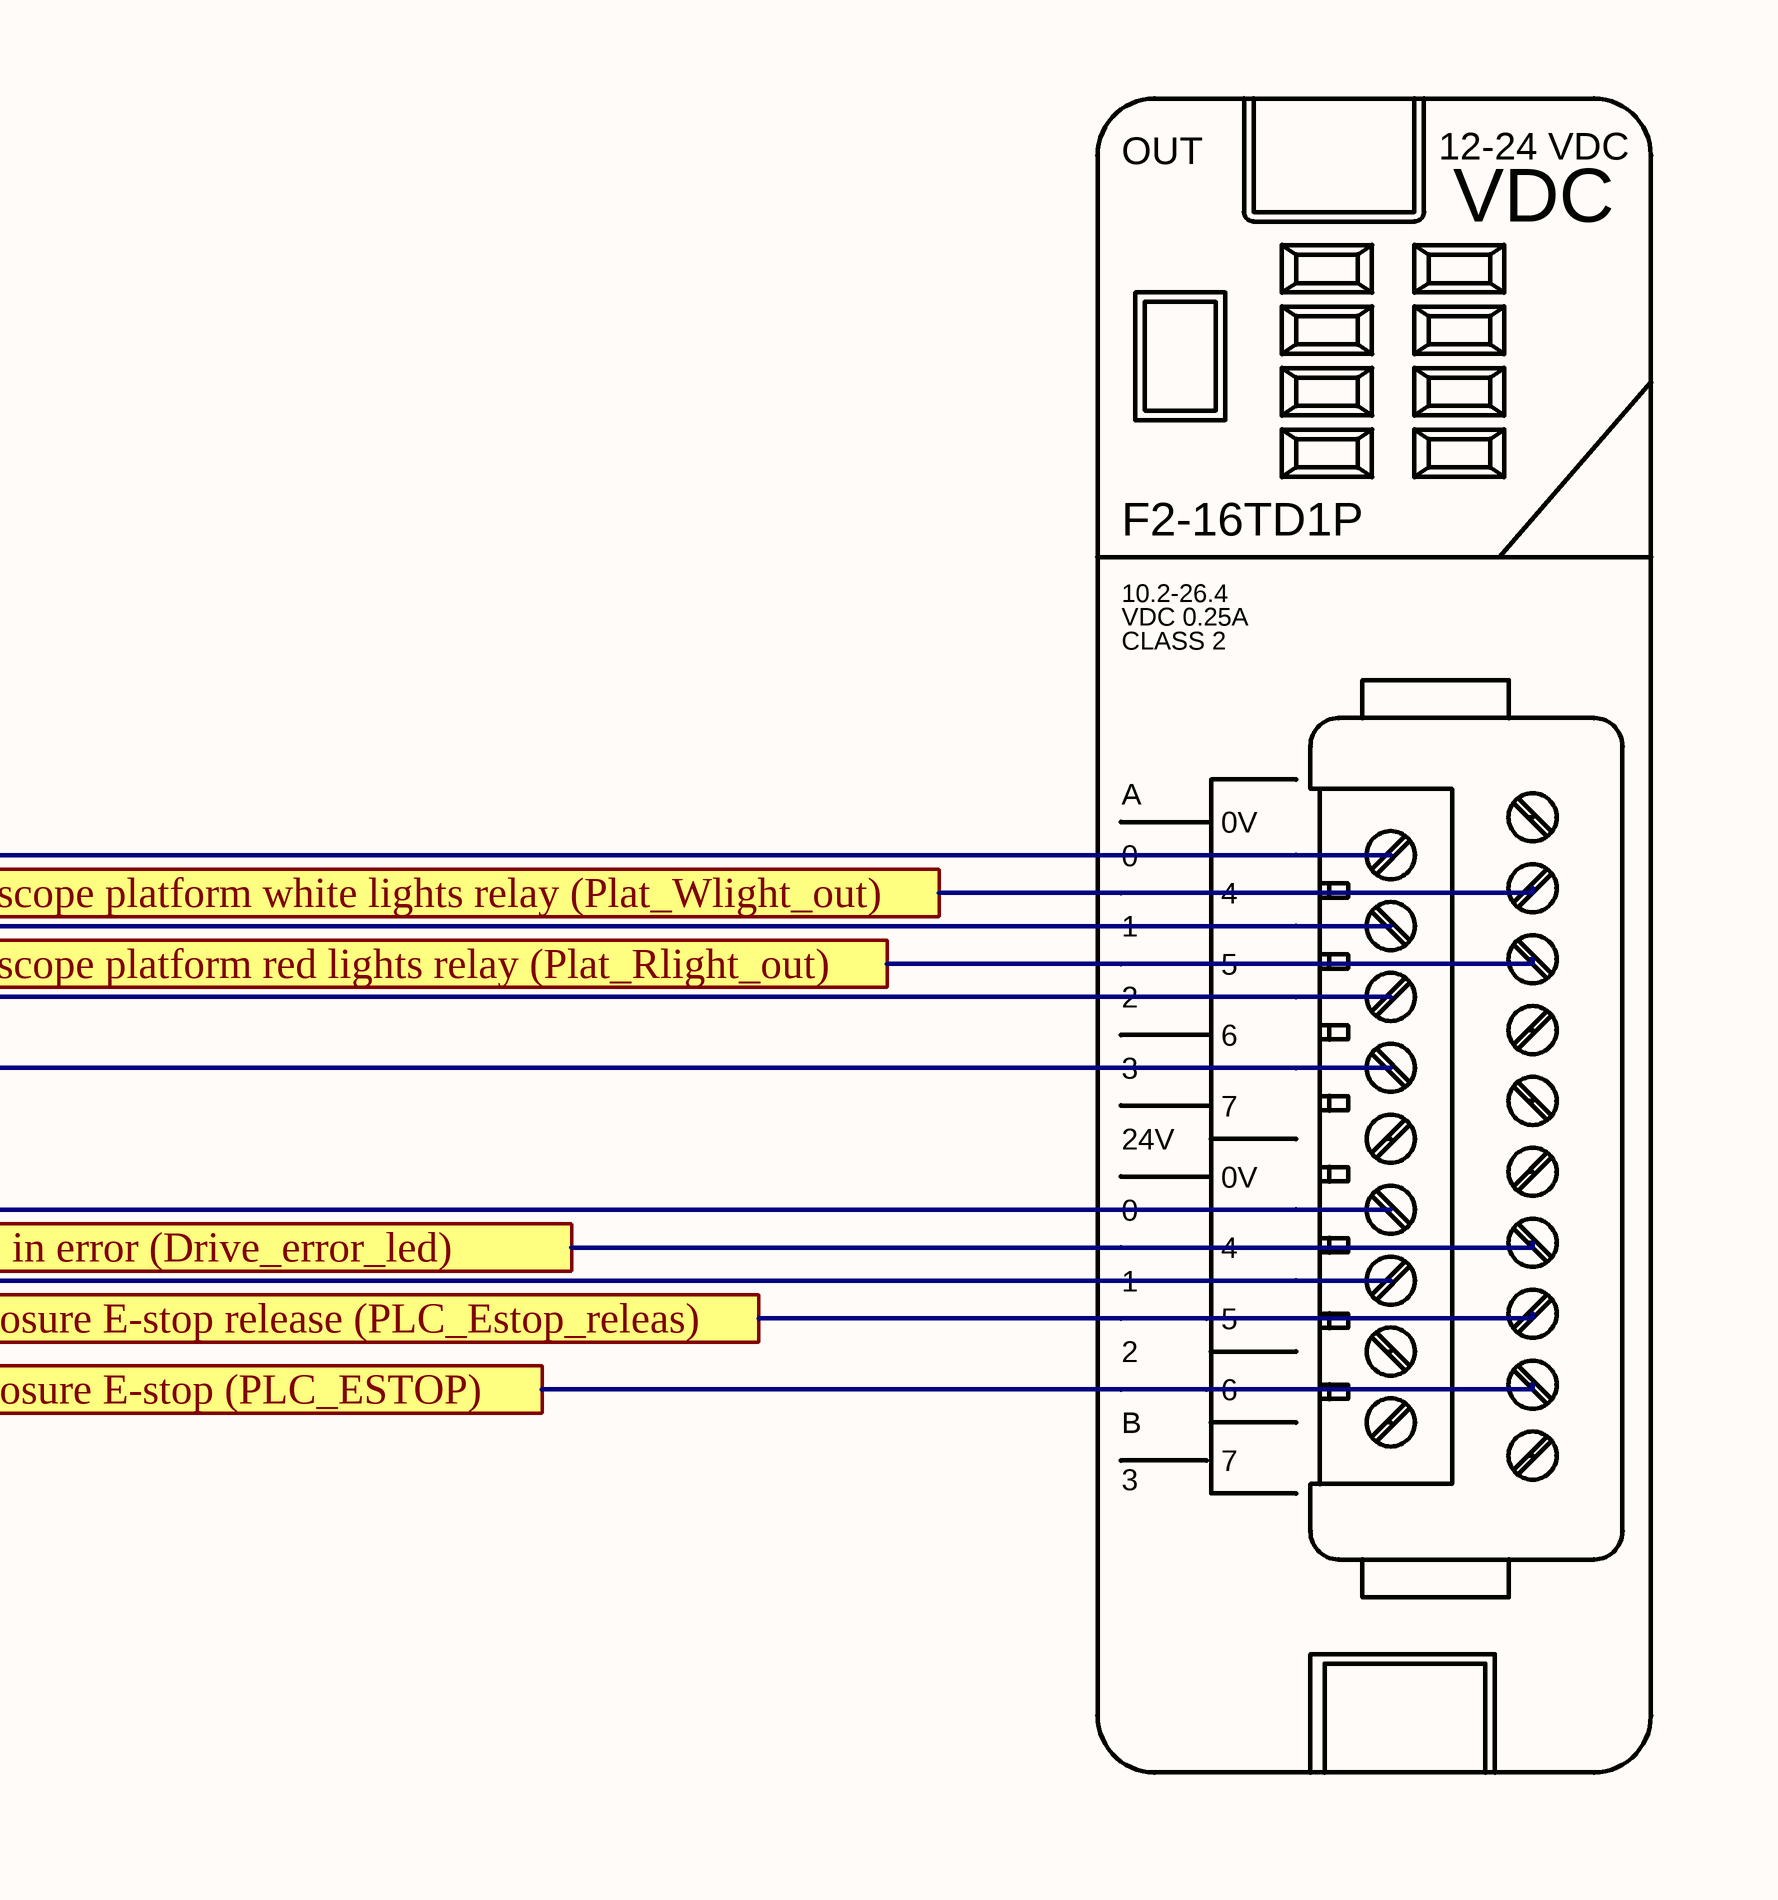
[diagram p12: PLC out.SchDoc, bottom column 4 of 4]

### Parts
(Parts that share a designator on the sheet are numbered #1, #2 ... from top to bottom, then left to right.)
*#1  F2-16TD1P  (value not drawn)

### Ports
Control room light releay (Clt_lights_out) (out), Enclosure E-stop (PLC_ESTOP) (out), Enclosure E-stop release (PLC_Estop_releas) (out), GS3 in error (Drive_error_led) (out), HVAC flag (HVAC_flag) (out), Mezzanine room light releay (MZE_lights_out) (out), Release motor brake (Brake_start) (out), Spectrograph room light releay (Spec_lights_out) (out), Telescope platform red lights relay (Plat_Rlight_out) (out), Telescope platform white lights relay (Plat_Wlight_out) (out), Utilities room light relay (Utl_lights_out) (out)

### Nets
Net*#1_?1: *#1.?1(A0) ; port Control room light releay (Clt_lights_out)
Net*#1_?2: *#1.?2(A1) ; port Utilities room light relay (Utl_lights_out)
Net*#1_?3: *#1.?3(A4) ; port Telescope platform white lights relay (Plat_Wlight_out)
Net*#1_?4: *#1.?4(A5) ; port Telescope platform red lights relay (Plat_Rlight_out)
Net*#1_?5: *#1.?5(A2) ; port Spectrograph room light releay (Spec_lights_out)
Net*#1_?7: *#1.?7(A3) ; port Mezzanine room light releay (MZE_lights_out)
Net*#1_?11: *#1.?11(B0) ; port HVAC flag (HVAC_flag)
Net*#1_?12: *#1.?12(B1) ; port Release motor brake (Brake_start)
Net*#1_?13: *#1.?13(B4) ; port GS3 in error (Drive_error_led)
Net*#1_?15: *#1.?15(B5) ; port Enclosure E-stop release (PLC_Estop_releas)
Net*#1_?17: *#1.?17(B6) ; port Enclosure E-stop (PLC_ESTOP)

Not connected (* = marked no-connect by the designer): *#1 ?6(A6) ?8(A7) ?9(24V) ?10(0V) ?14(B2) ?16(B3) ?18(B7) ?19(0V)

### Notes on the sheet
- (in symbol F2-16TD1P) 12-24 VDC; OUT; VDC; 10.2-26.4; VDC 0.25A; CLASS 2; A; 0; 4; 1; 5; 2; 6; 3; 7; B

## Sheet PLC in.SchDoc: Enclosure PLC inputs
size A4; Author: Felipe Besser P.; CompanyName: Observatorio Las Campanas; DrawnBy: Felipe Besser P.; DocumentNumber: 2; Revision: 1; SheetNumber: 3; SheetTotal: 3
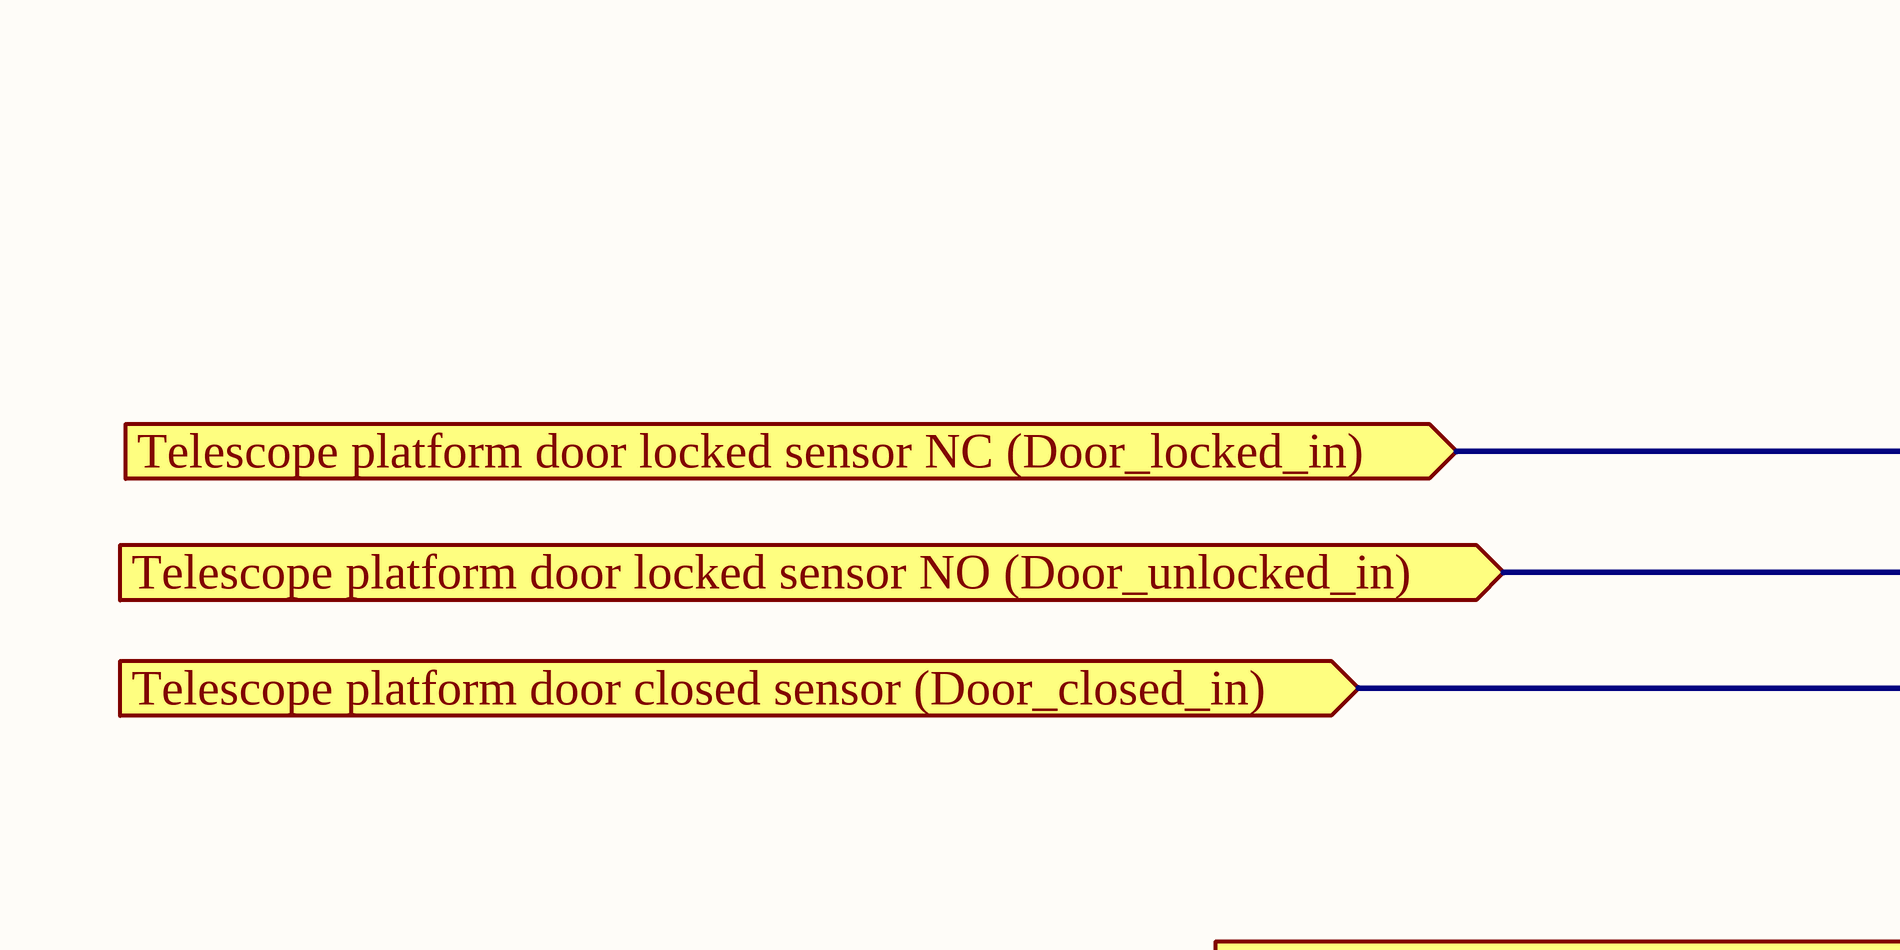
[diagram p13: PLC in.SchDoc, centre column 3 of 4]
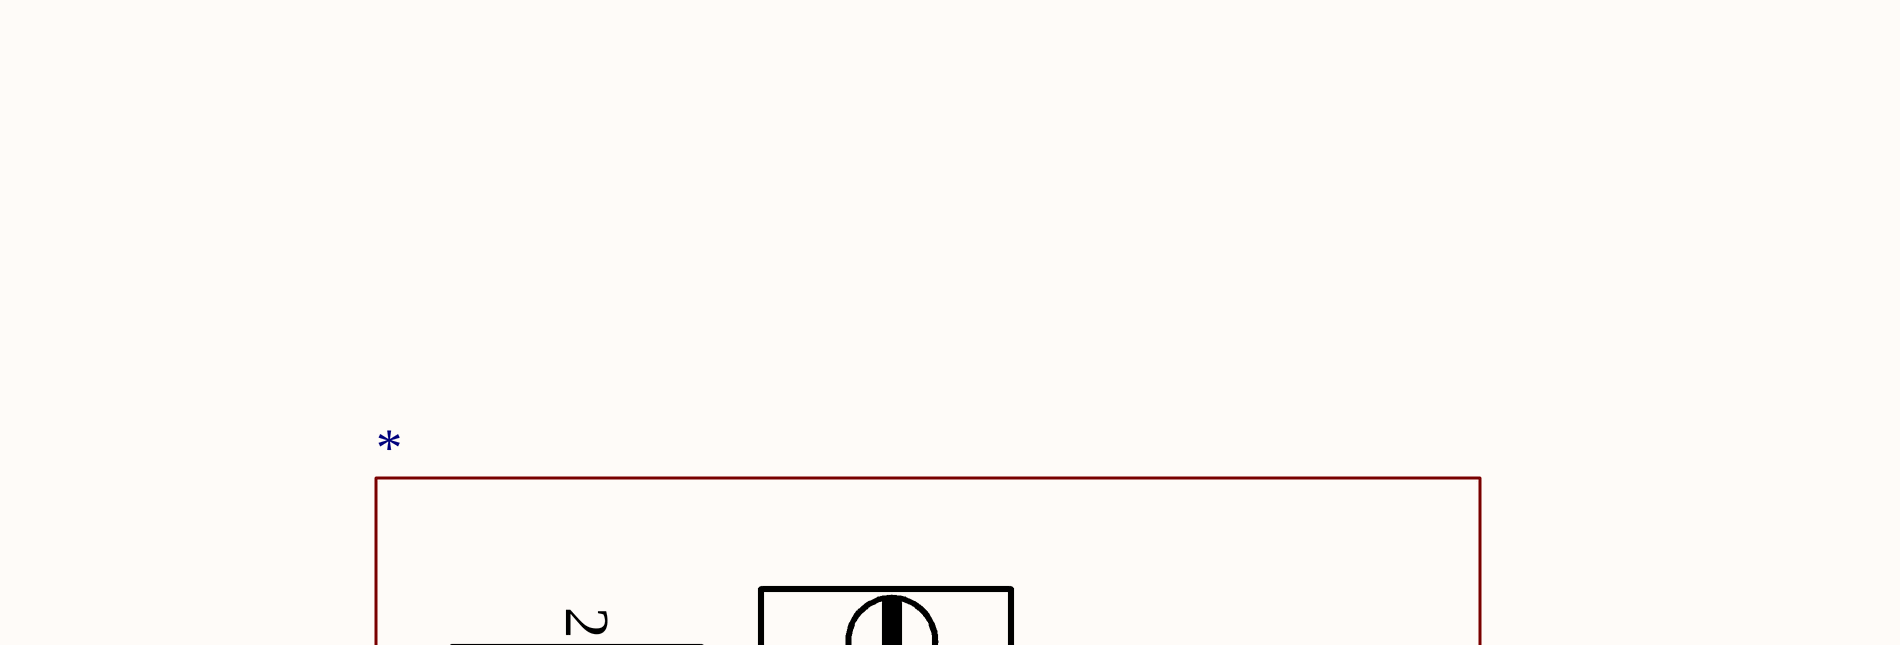
[diagram p14: PLC in.SchDoc, centre column 4 of 4]
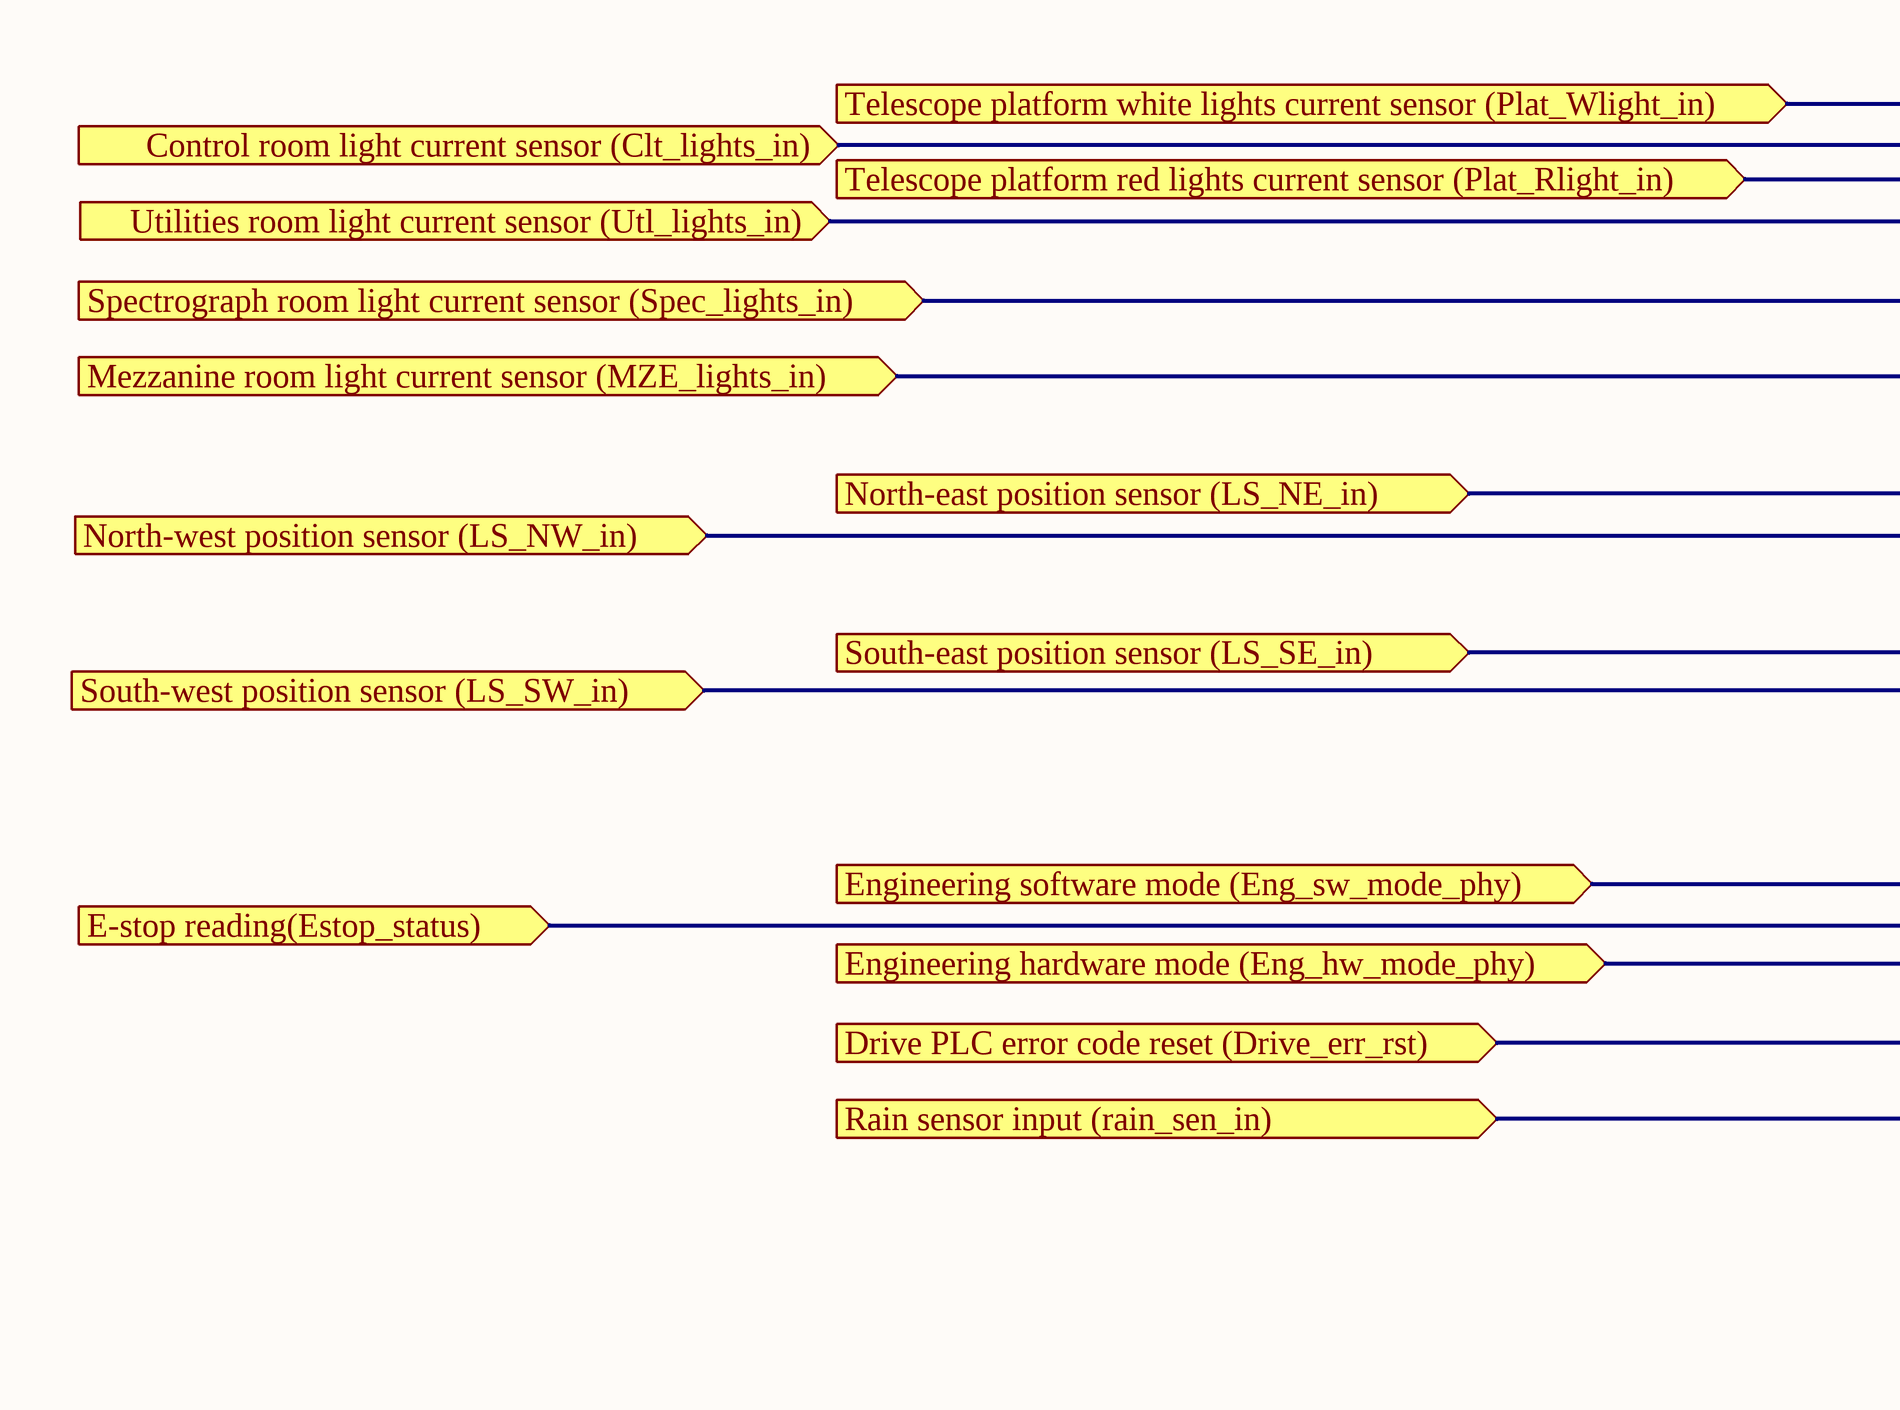
[diagram p15: PLC in.SchDoc, bottom column 3 of 4]
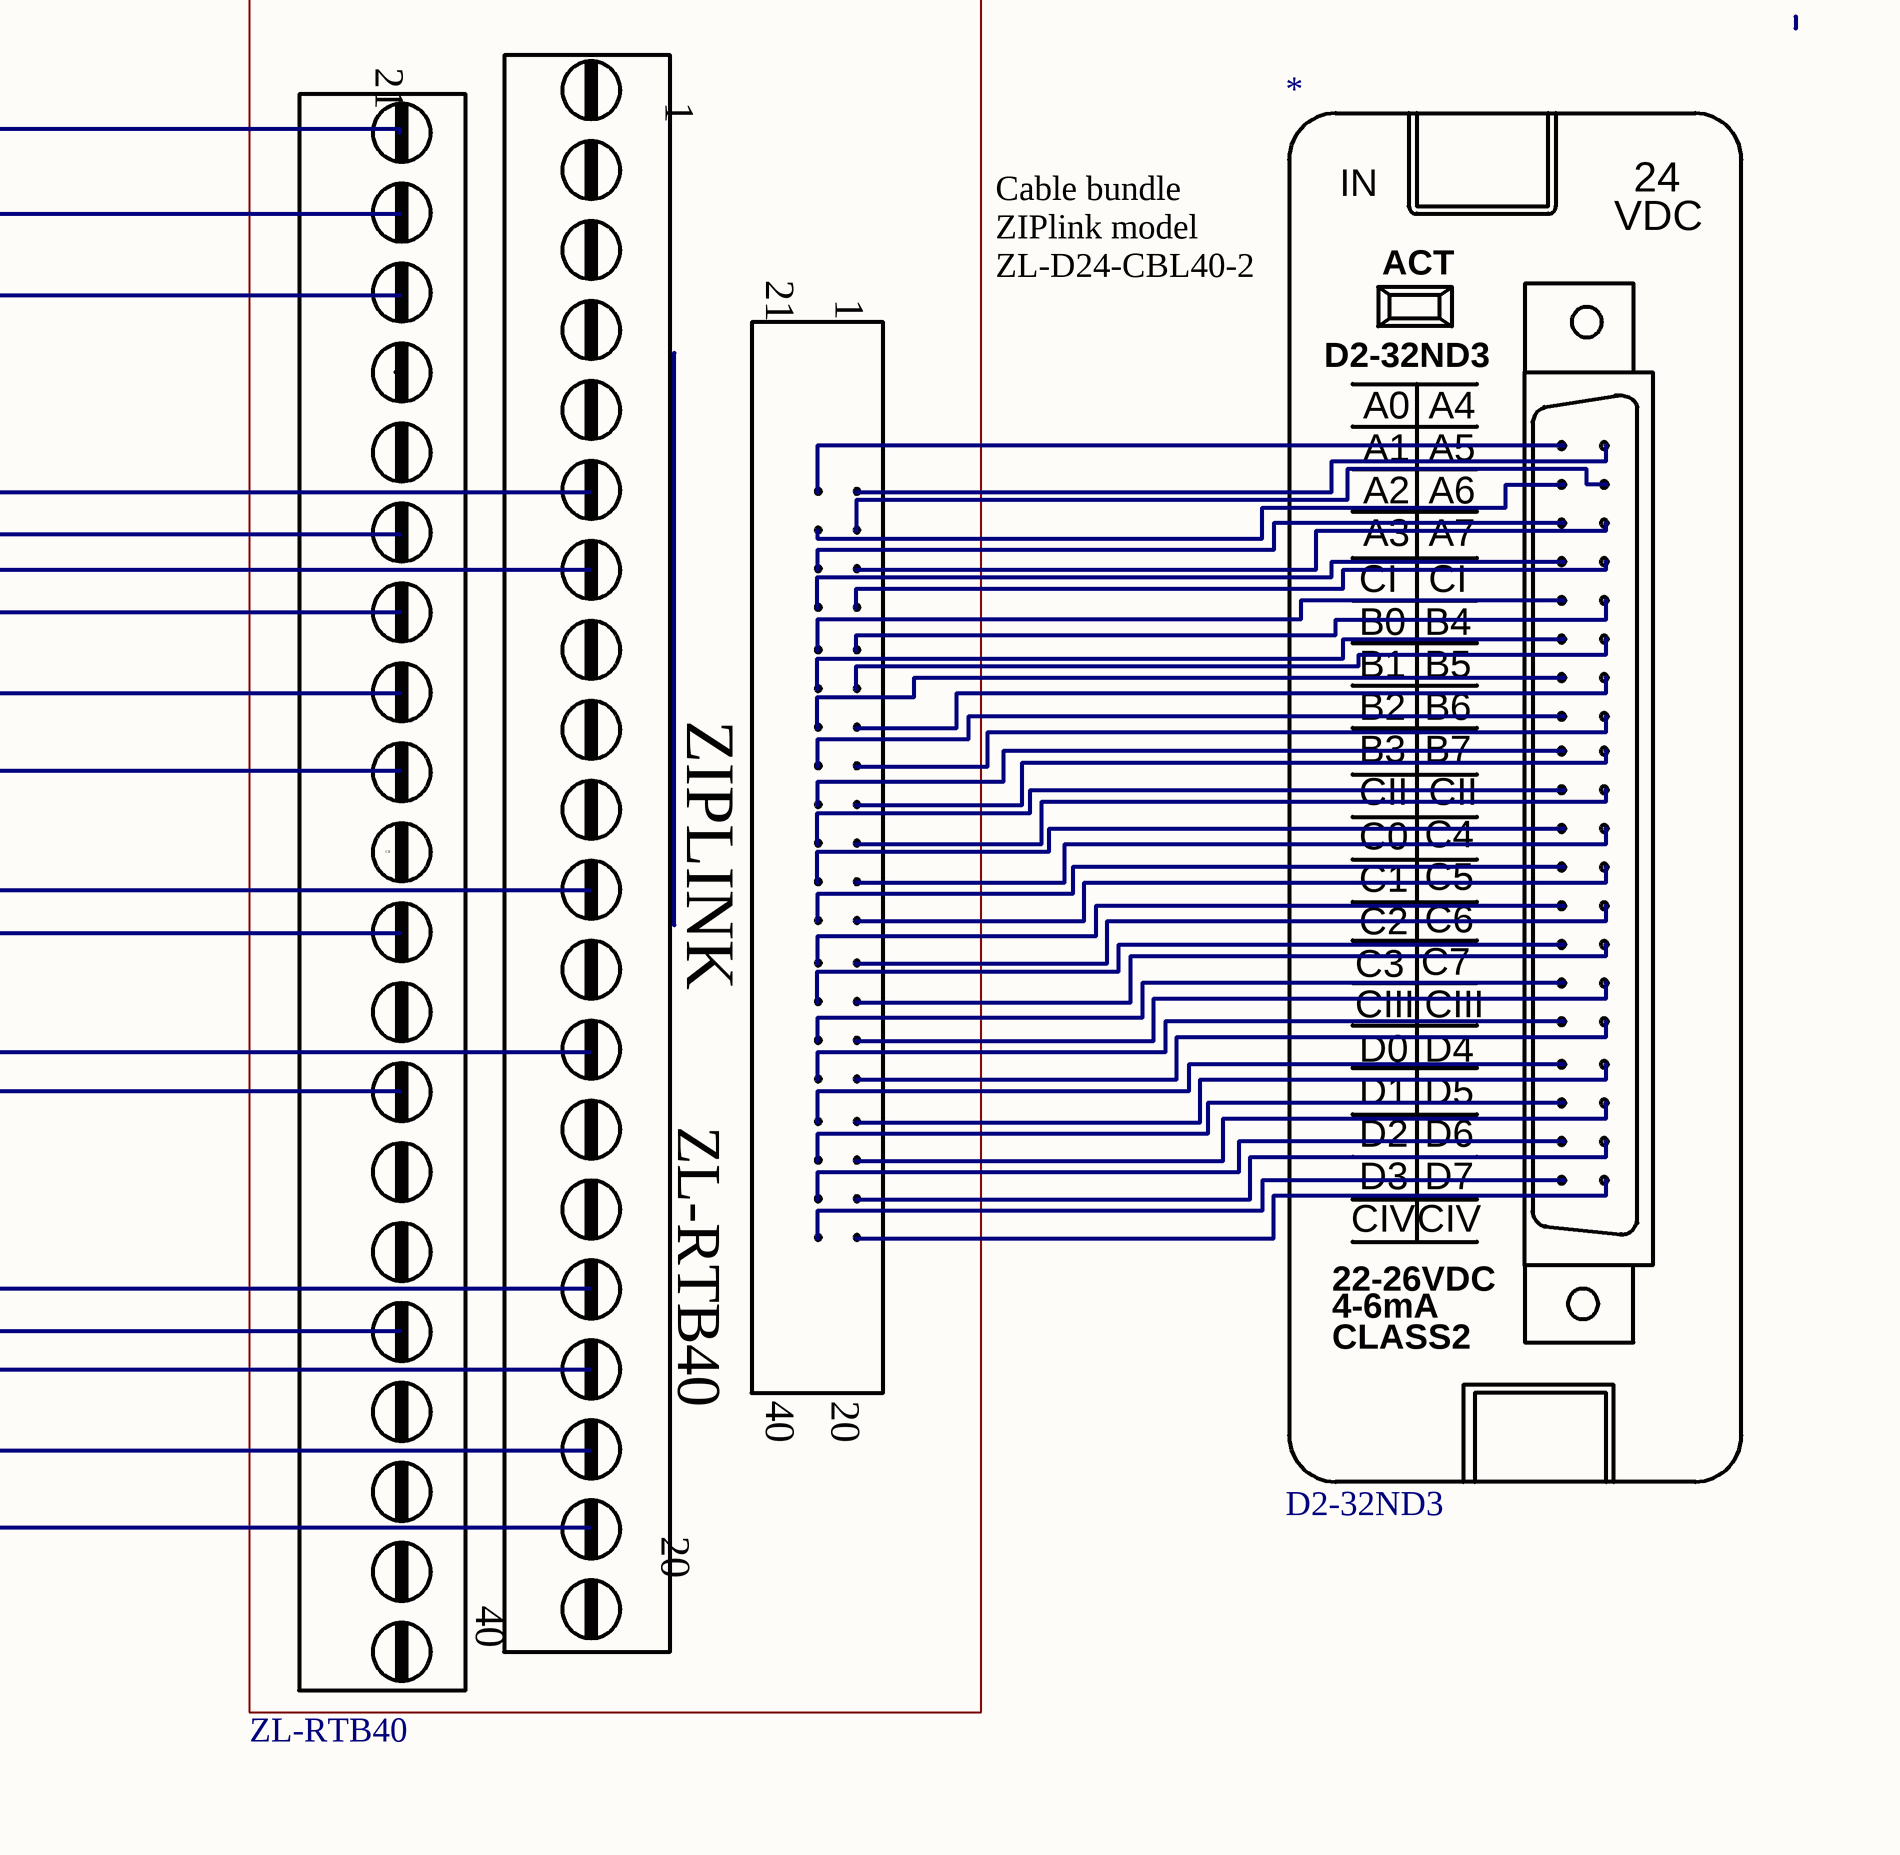
[diagram p16: PLC in.SchDoc, bottom column 4 of 4]

### Parts
(Parts that share a designator on the sheet are numbered #1, #2 ... from top to bottom, then left to right.)
*#2  ZL-RTB40
*#3  D2-32ND3

### Ports
Control room light current sensor (Clt_lights_in) (in), Drive PLC error code reset (Drive_err_rst) (in), E-stop reading(Estop_status) (in), Engineering hardware mode (Eng_hw_mode_phy) (in), Engineering software mode (Eng_sw_mode_phy) (in), Mezzanine room light current sensor (MZE_lights_in) (in), North-east position sensor (LS_NE_in) (in), North-west position sensor (LS_NW_in) (in), Rain sensor input (rain_sen_in) (in), South-east position sensor (LS_SE_in) (in), South-west position sensor (LS_SW_in) (in), Spectrograph room light current sensor (Spec_lights_in) (in), Telescope platform door closed sensor (Door_closed_in) (in), Telescope platform door locked sensor NC (Door_locked_in) (in), Telescope platform door locked sensor NO (Door_unlocked_in)  (in), Telescope platform red lights current sensor (Plat_Rlight_in) (in), Telescope platform white lights current sensor (Plat_Wlight_in) (in), Utilities room light current sensor (Utl_lights_in) (in)

### Nets
Net*#2_?1: *#2.?1 *#3.?1(A0)
Net*#2_?2: *#2.?2 *#3.?2(A1)
Net*#2_?3: *#2.?3 *#3.?3(A2)
Net*#2_?4: *#2.?4 *#3.?4(A3)
Net*#2_?5: *#2.?5 *#3.?5(CI)
Net*#2_?6: *#2.?6 *#3.?6(B0)
Net*#2_?7: *#2.?7 *#3.?7(B1)
Net*#2_?8: *#2.?8 *#3.?8(B2)
Net*#2_?9: *#2.?9 *#3.?9(B3)
Net*#2_?10: *#2.?10 *#3.?10(CII)
Net*#2_?11: *#2.?11 *#3.?11(C0)
Net*#2_?12: *#2.?12 *#3.?12(C1)
Net*#2_?13: *#2.?13 *#3.?13(C2)
Net*#2_?14: *#2.?14 *#3.?14(C3)
Net*#2_?15: *#2.?15 *#3.?15(CIII)
Net*#2_?16: *#2.?16 *#3.?16(D0)
Net*#2_?17: *#2.?17 *#3.?17(D1)
Net*#2_?18: *#2.?18 *#3.?18(D2)
Net*#2_?19: *#2.?19 *#3.?19(D3)
Net*#2_?20: *#2.?20 *#3.?20(CIV)
Net*#2_?21: *#2.?21 *#3.?21(CIV)
Net*#2_?22: *#2.?22 *#3.?22(D7)
Net*#2_?23: *#2.?23 *#3.?23(D6)
Net*#2_?24: *#2.?24 *#3.?24(D5)
Net*#2_?25: *#2.?25 *#3.?25(D4)
Net*#2_?26: *#2.?26 *#3.?26(CIII)
Net*#2_?27: *#2.?27 *#3.?27(C7)
Net*#2_?28: *#2.?28 *#3.?28(C6)
Net*#2_?29: *#2.?29 *#3.?29(C5)
Net*#2_?30: *#2.?30 *#3.?30(C4)
Net*#2_?31: *#2.?31 *#3.?31(CII)
Net*#2_?32: *#2.?32 *#3.?32(B7)
Net*#2_?33: *#2.?33 *#3.?33(B6)
Net*#2_?34: *#2.?34 *#3.?34(B5)
Net*#2_?35: *#2.?35 *#3.?35(B4)
Net*#2_?36: *#2.?36 *#3.?36(CI)
Net*#2_?37: *#2.?37 *#3.?37(A7)
Net*#2_?38: *#2.?38 *#3.?38(A6)
Net*#2_?39: *#2.?39 *#3.?39(A5)
Net*#2_?40: *#2.?40 *#3.?40(A4)
Net*#2_?41: *#2.?41(A0) ; port Telescope platform door locked sensor NC (Door_locked_in)
Net*#2_?42: *#2.?42(A1) ; port Telescope platform door locked sensor NO (Door_unlocked_in) 
Net*#2_?43: *#2.?43(A2) ; port Telescope platform door closed sensor (Door_closed_in)
Net*#2_?46: *#2.?46(B0) ; port Control room light current sensor (Clt_lights_in)
Net*#2_?47: *#2.?47(B1) ; port Utilities room light current sensor (Utl_lights_in)
Net*#2_?48: *#2.?48(B2) ; port Spectrograph room light current sensor (Spec_lights_in)
Net*#2_?49: *#2.?49(B3) ; port Mezzanine room light current sensor (MZE_lights_in)
Net*#2_?51: *#2.?51(C0) ; port North-west position sensor (LS_NW_in)
Net*#2_?53: *#2.?53(C2) ; port South-west position sensor (LS_SW_in)
Net*#2_?56: *#2.?56(D0) ; port E-stop reading(Estop_status)
Net*#2_?62: *#2.?62(D7) ; port Rain sensor input (rain_sen_in)
Net*#2_?63: *#2.?63(D6) ; port Drive PLC error code reset (Drive_err_rst)
Net*#2_?64: *#2.?64(D5) ; port Engineering hardware mode (Eng_hw_mode_phy)
Net*#2_?65: *#2.?65(D4) ; port Engineering software mode (Eng_sw_mode_phy)
Net*#2_?68: *#2.?68(C6) ; port South-east position sensor (LS_SE_in)
Net*#2_?70: *#2.?70(C4) ; port North-east position sensor (LS_NE_in)
Net*#2_?74: *#2.?74(B5) ; port Telescope platform red lights current sensor (Plat_Rlight_in)
Net*#2_?75: *#2.?75(B4) ; port Telescope platform white lights current sensor (Plat_Wlight_in)

Not connected (* = marked no-connect by the designer): *#2 ?44(A3) ?45(CI) ?50(CII) ?52(C1) ?54(C3) ?55(CIII) ?57(D1) ?58(D2) ?59(D3) ?60(CIV) ?61(CIV) ?66(CIII) ?67(C7) ?69(C5) ?71(CII) ?72(B7) ?73(B6) ?76(CI) ?77(A7) ?78(A6) ?79(A5) ?80(A4)

### Notes on the sheet
- (near *#2) Cable bundle ZIPlink model ZL-D24-CBL40-2
- (in symbol D2-32ND3) IN; 24; VDC; ACT; 22-26VDC; 4-6mA; CLASS2
- (in symbol ZL-RTB40) ZIPLINK